# EAGLE design Daughter Card Schematic v3 (EAGLE 6.5.1)
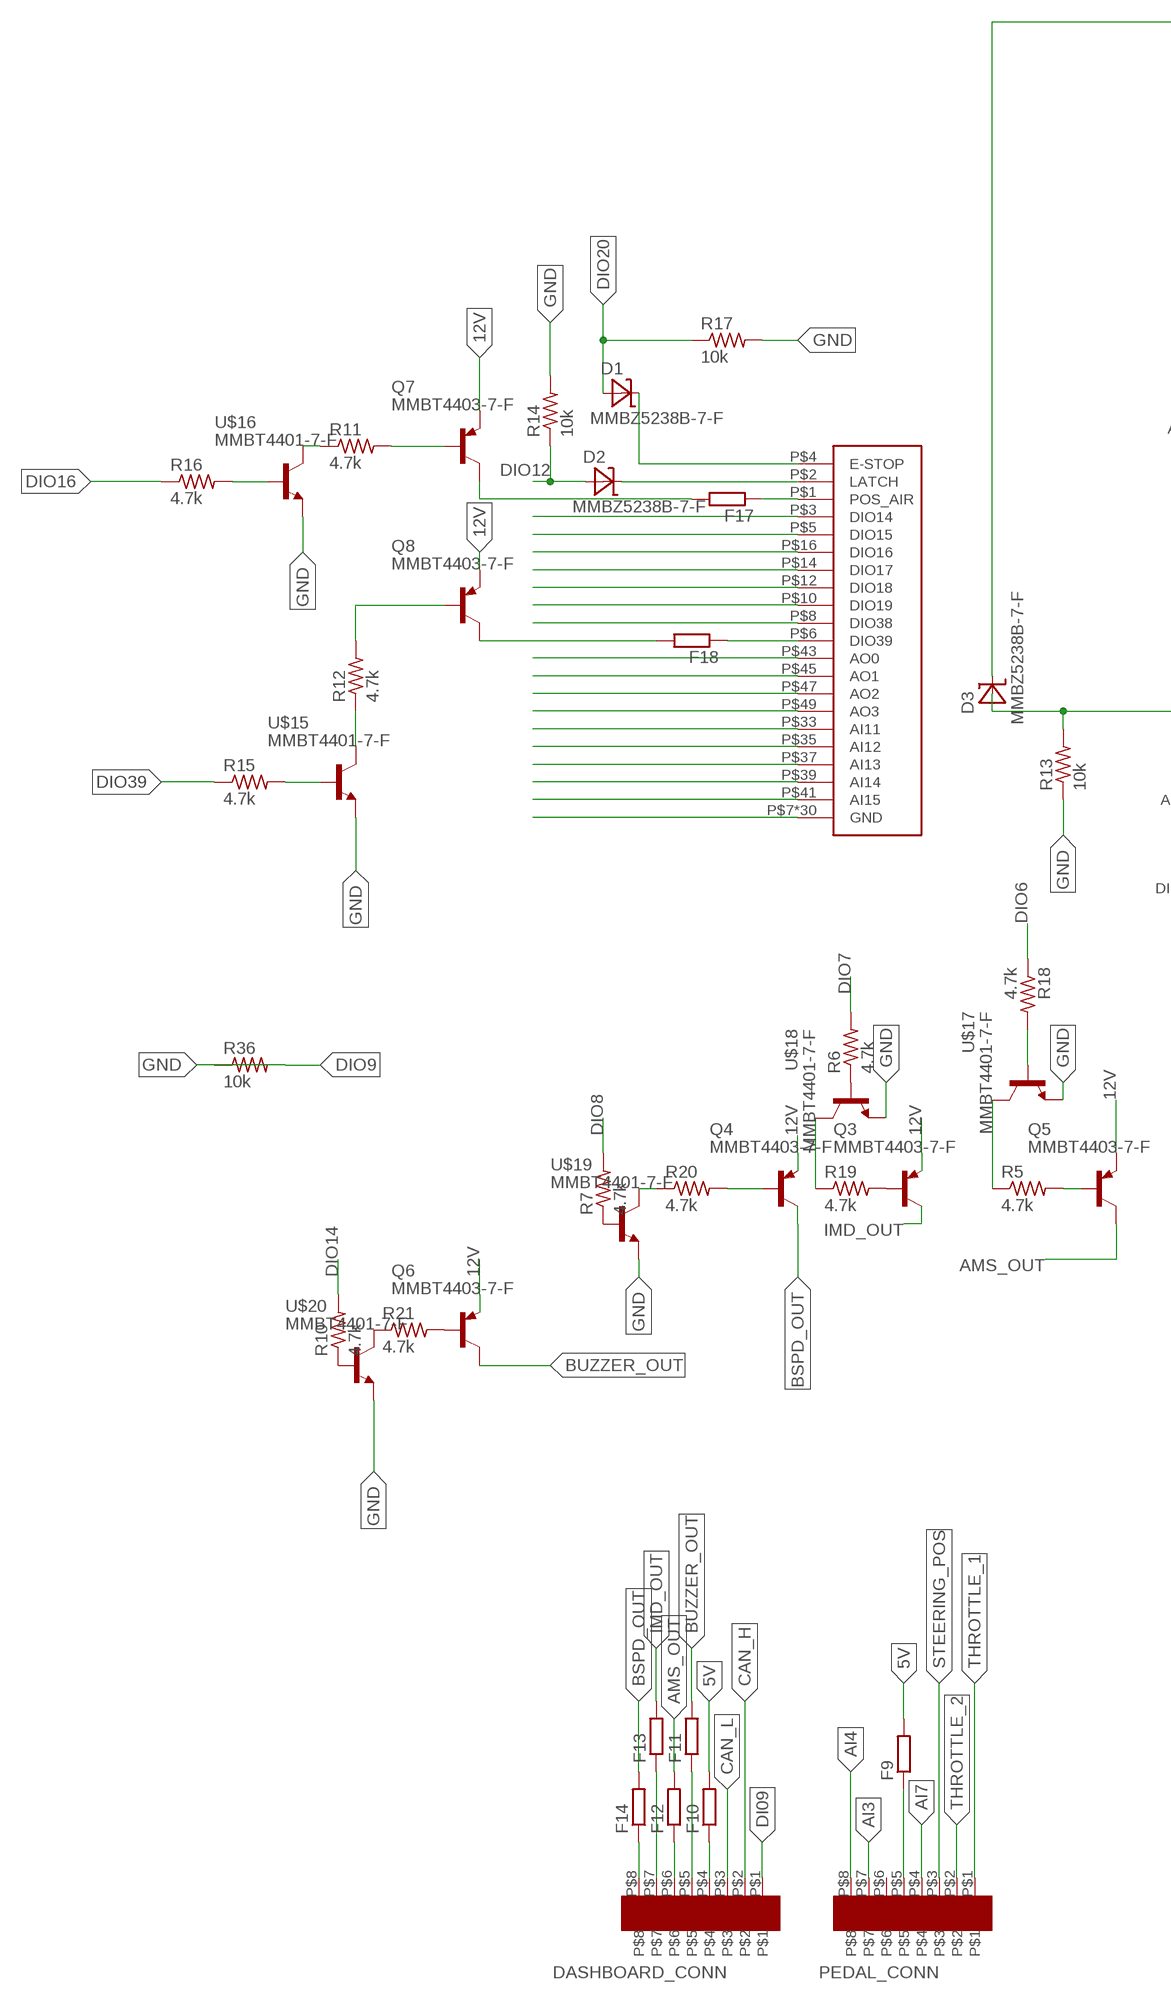
[diagram p0: schematic, sheet 1, part 1 of 2]
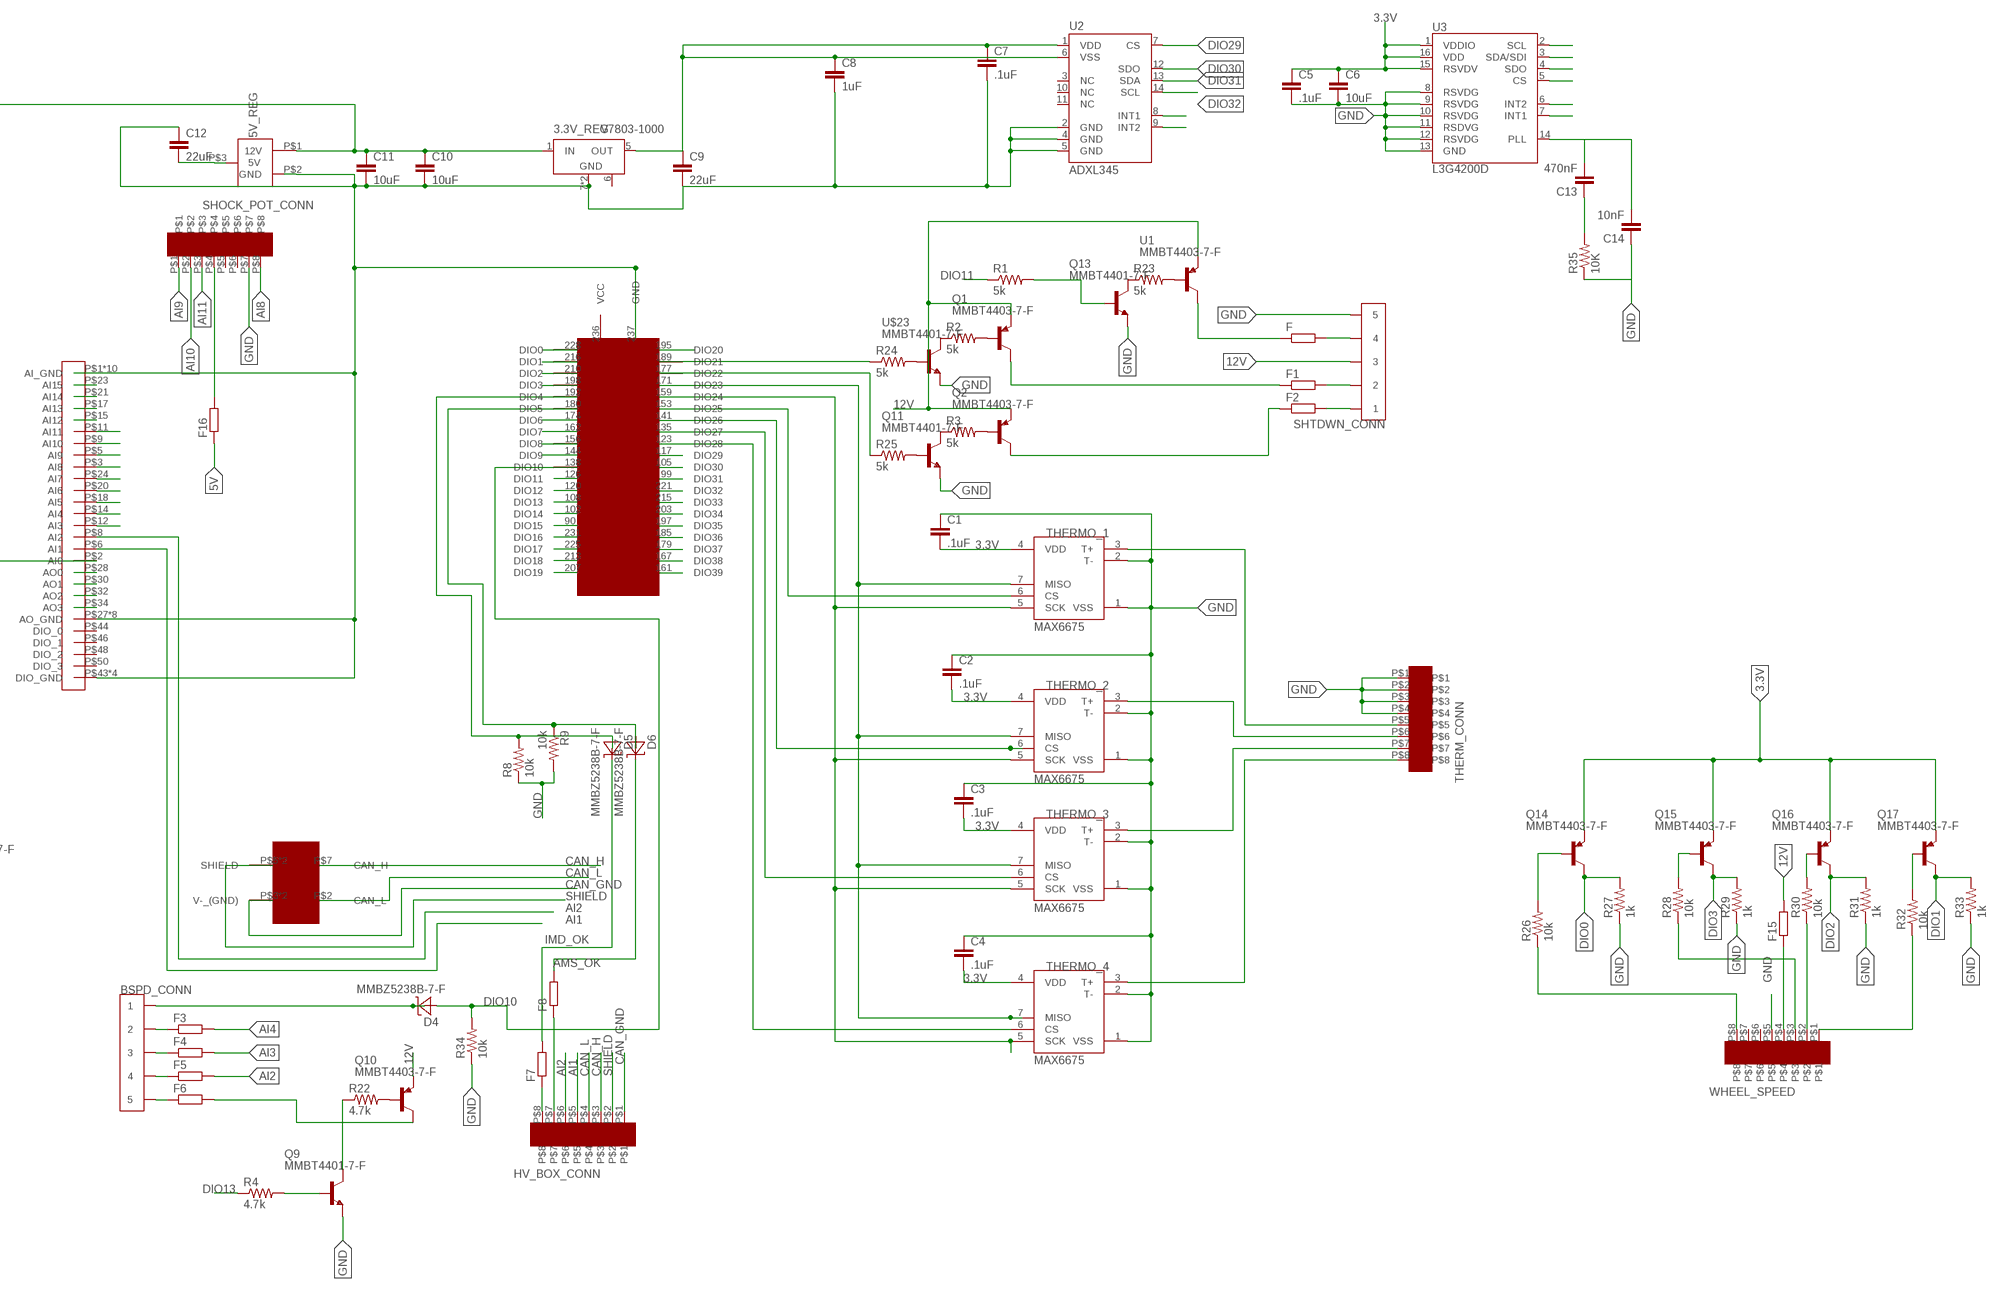
[diagram p1: schematic, sheet 1, part 2 of 2]

## Parts
3.3V_REG  V7803-1000  [V78XX-1000]
5V_REG  V78XX-1500  [V78XX-1500R]
BSPD_CONN  CONN_5  [CONNECTOR_5]
C1  .1uF  CAP0603-CAP  [0603-CAP]
C2  .1uF  CAP0603-CAP  [0603-CAP]
C3  .1uF  CAP0603-CAP  [0603-CAP]
C4  .1uF  CAP0603-CAP  [0603-CAP]
C5  .1uF  CAP0603-CAP  [0603-CAP]
C6  10uF  CAP0603-CAP  [0603-CAP]
C7  .1uF  CAP0603-CAP  [0603-CAP]
C8  1uF  CAP0603-CAP  [0603-CAP]
C9  22uF  CAP0603-CAP  [0603-CAP]
C10  10uF  CAP0603-CAP  [0603-CAP]
C11  10uF  CAP0603-CAP  [0603-CAP]
C12  22uF  CAP0603-CAP  [0603-CAP]
C13  470nF  CAP0603-CAP  [0603-CAP]
C14  10nF  CAP0603-CAP  [0603-CAP]
D1  MMBZ5238B-7-F  [SOT-23-3]
D2  MMBZ5238B-7-F  [SOT-23-3]
D3  MMBZ5238B-7-F  [SOT-23-3]
D4  MMBZ5238B-7-F  [SOT-23-3]
D5  MMBZ5238B-7-F  [SOT-23-3]
D6  MMBZ5238B-7-F  [SOT-23-3]
DASHBOARD_CONN  EN3_PCB_8  [EN3_PCB_8]
F  R-EU_R0402  [R0402]
F1  R-EU_R0402  [R0402]
F2  R-EU_R0402  [R0402]
F3  R-EU_R0402  [R0402]
F4  R-EU_R0402  [R0402]
F5  R-EU_R0402  [R0402]
F6  R-EU_R0402  [R0402]
F7  R-EU_R0402  [R0402]
F8  R-EU_R0402  [R0402]
F9  R-EU_R0402  [R0402]
F10  R-EU_R0402  [R0402]
F11  R-EU_R0402  [R0402]
F12  R-EU_R0402  [R0402]
F13  R-EU_R0402  [R0402]
F14  R-EU_R0402  [R0402]
F15  R-EU_R0402  [R0402]
F16  R-EU_R0402  [R0402]
F17  R-EU_R0402  [R0402]
F18  R-EU_R0402  [R0402]
HV_BOX_CONN  EN3_PCB_8  [EN3_PCB_8]
PEDAL_CONN  EN3_PCB_8  [EN3_PCB_8]
Q1  MMBT4403-7-F  [SOT-23-3]
Q2  MMBT4403-7-F  [SOT-23-3]
Q3  MMBT4403-7-F  [SOT-23-3]
Q4  MMBT4403-7-F  [SOT-23-3]
Q5  MMBT4403-7-F  [SOT-23-3]
Q6  MMBT4403-7-F  [SOT-23-3]
Q7  MMBT4403-7-F  [SOT-23-3]
Q8  MMBT4403-7-F  [SOT-23-3]
Q9  MMBT4401-7-F  [SOT-23-3]
Q10  MMBT4403-7-F  [SOT-23-3]
Q11  MMBT4401-7-F  [SOT-23-3]
Q13  MMBT4401-7-F  [SOT-23-3]
Q14  MMBT4403-7-F  [SOT-23-3]
Q15  MMBT4403-7-F  [SOT-23-3]
Q16  MMBT4403-7-F  [SOT-23-3]
Q17  MMBT4403-7-F  [SOT-23-3]
R1  5k  R-US_R0402  [R0402]
R2  5k  R-US_R0402  [R0402]
R3  5k  R-US_R0402  [R0402]
R4  4.7k  R-US_R0402  [R0402]
R5  4.7k  R-US_R0402  [R0402]
R6  4.7k  R-US_R0402  [R0402]
R7  4.7k  R-US_R0402  [R0402]
R8  10k  R-US_R0402  [R0402]
R9  10k  R-US_R0402  [R0402]
R10  4.7k  R-US_R0402  [R0402]
R11  4.7k  R-US_R0402  [R0402]
R12  4.7k  R-US_R0402  [R0402]
R13  10k  R-US_R0402  [R0402]
R14  10k  R-US_R0402  [R0402]
R15  4.7k  R-US_R0402  [R0402]
R16  4.7k  R-US_R0402  [R0402]
R17  10k  R-US_R0402  [R0402]
R18  4.7k  R-US_R0402  [R0402]
R19  4.7k  R-US_R0402  [R0402]
R20  4.7k  R-US_R0402  [R0402]
R21  4.7k  R-US_R0402  [R0402]
R22  4.7k  R-US_R0402  [R0402]
R23  5k  R-US_R0402  [R0402]
R24  5k  R-US_R0402  [R0402]
R25  5k  R-US_R0402  [R0402]
R26  10k  R-US_R0402  [R0402]
R27  1k  R-US_R0402  [R0402]
R28  10k  R-US_R0402  [R0402]
R29  1k  R-US_R0402  [R0402]
R30  10k  R-US_R0402  [R0402]
R31  1k  R-US_R0402  [R0402]
R32  10k  R-US_R0402  [R0402]
R33  1k  R-US_R0402  [R0402]
R34  10k  R-US_R0402  [R0402]
R35  10K  RESISTOR0603-RES  [0603-RES]
R36  10k  R-US_R0402  [R0402]
SBRIO_ANALOG  SBRIO_MIO  [SBRIO_J502_J503]
SBRIO_AUX  SBRIO_AUX  [SBRIO_J502_J503]
SHOCK_POT_CONN  EN3_PCB_8  [EN3_PCB_8]
SHTDWN_CONN  CONN_5  [CONNECTOR_5]
THERM_CONN  EN3_PCB_8  [EN3_PCB_8]
THERMO_1  MAX6675  [SO08]
THERMO_2  MAX6675  [SO08]
THERMO_3  MAX6675  [SO08]
THERMO_4  MAX6675  [SO08]
U1  MMBT4403-7-F  [SOT-23-3]
U2  ADXL345  [LGA14]
U3  L3G4200D  [LGA16-4X4]
U$2  SBRIO_W500  [SBRIO_W]
U$3  SBRIO_RMC  [SEAM-40-XX.X-XX-06-X-A]
U$15  MMBT4401-7-F  [SOT-23-3]
U$16  MMBT4401-7-F  [SOT-23-3]
U$17  MMBT4401-7-F  [SOT-23-3]
U$18  MMBT4401-7-F  [SOT-23-3]
U$19  MMBT4401-7-F  [SOT-23-3]
U$20  MMBT4401-7-F  [SOT-23-3]
U$23  MMBT4401-7-F  [SOT-23-3]
WHEEL_SPEED  EN3_PCB_8  [EN3_PCB_8]

## Nets
3.3V: 3.3V_REG.5(OUT) C1.2 C2.2 C3.2 C4.2 C5.1 C6.1 C7.1 C8.1 C9.1 Q14.P$3(E) Q15.P$3(E) Q16.P$3(E) Q17.P$3(E) THERMO_1.4(VDD) THERMO_2.4(VDD) THERMO_3.4(VDD) THERMO_4.4(VDD) U2.1(VDD) U2.6(VSS) U3.1(VDDIO) U3.15(RSVDV) U3.16(VDD)
5V: 5V_REG.P$3(5V) C12.2 F9.2 F10.2 F16.1
12V: 3.3V_REG.1(IN) 5V_REG.P$1(12V) C10.1 C11.1 D3.P$1(C) F15.2 Q1.P$3(E) Q2.P$3(E) Q3.P$3(E) Q4.P$3(E) Q5.P$3(E) Q6.P$3(E) Q7.P$3(E) Q8.P$3(E) Q10.P$3(E) SHTDWN_CONN.5 SHTDWN_CONN.6 U1.P$3(E)
AI1: HV_BOX_CONN.P$5 SBRIO_ANALOG.P$6(AI1)
AI2: F5.2 HV_BOX_CONN.P$6 SBRIO_ANALOG.P$8(AI2)
AI3: F4.2 PEDAL_CONN.P$7 SBRIO_ANALOG.P$12(AI3)
AI4: F3.2 PEDAL_CONN.P$8 SBRIO_ANALOG.P$14(AI4)
AI7: PEDAL_CONN.P$4 SBRIO_ANALOG.P$24(AI7)
AI8: SBRIO_ANALOG.P$3(AI8) SHOCK_POT_CONN.P$8
AI9: SBRIO_ANALOG.P$5(AI9) SHOCK_POT_CONN.P$1
AI10: SBRIO_ANALOG.P$9(AI10) SHOCK_POT_CONN.P$2
AI11: SBRIO_ANALOG.P$11(AI11) SBRIO_AUX.P$33(AI11) SHOCK_POT_CONN.P$3
AI12: SBRIO_ANALOG.P$15(AI12) SBRIO_AUX.P$35(AI12)
AI13: SBRIO_ANALOG.P$17(AI13) SBRIO_AUX.P$37(AI13)
AI15: SBRIO_ANALOG.P$23(AI15) SBRIO_AUX.P$41(AI15)
AMS_OK: D6.P$1(C) F8.2
AMS_OUT: F12.2 Q5.P$1(C)
AO0: SBRIO_ANALOG.P$28(AO0) SBRIO_AUX.P$43(AO0)
AO1: SBRIO_ANALOG.P$30(AO1) SBRIO_AUX.P$45(AO1)
AO2: SBRIO_ANALOG.P$32(AO2) SBRIO_AUX.P$47(AO2)
AO3: SBRIO_ANALOG.P$34(AO3) SBRIO_AUX.P$49(AO3)
BSPD_OUT: F14.2 Q4.P$1(C)
BUZZER_OUT: F11.2 Q6.P$1(C)
CAN_GND: HV_BOX_CONN.P$1 U$2.P$3(V-_(GND)) U$2.P$6(V-_(GND))
CAN_H: DASHBOARD_CONN.P$2 HV_BOX_CONN.P$3 U$2.P$7(CAN_H)
CAN_L: DASHBOARD_CONN.P$3 HV_BOX_CONN.P$4 U$2.P$2(CAN_L)
DI09: DASHBOARD_CONN.P$1
DIO0: Q14.P$1(C) R27.2 U$3.228(DIO0)
DIO1: Q17.P$1(C) R33.2 U$3.216(DIO1)
DIO2: Q16.P$1(C) R31.2 U$3.210(DIO2)
DIO3: Q15.P$1(C) R29.2 U$3.198(DIO3)
DIO6: R18.1 U$3.174(DIO6)
DIO7: R6.2 U$3.162(DIO7)
DIO8: R7.2 U$3.156(DIO8)
DIO9: R36.2 U$3.144(DIO9)
DIO10: D4.P$2(A) R34.2 U$3.138(DIO10)
DIO11: R1.1 U$3.126(DIO11)
DIO12: D2.P$2(A) R14.1 U$3.120(DIO12)
DIO13: R4.1 U$3.108(DIO13)
DIO14: R10.2 SBRIO_AUX.P$3(DIO14) U$3.102(DIO14)
DIO15: SBRIO_AUX.P$5(DIO15) U$3.90(DIO15)
DIO16: R16.1 SBRIO_AUX.P$16(DIO16) U$3.231(DIO16)
DIO17: SBRIO_AUX.P$14(DIO17) U$3.225(DIO17)
DIO18: SBRIO_AUX.P$12(DIO18) U$3.213(DIO18)
DIO19: SBRIO_AUX.P$10(DIO19) U$3.207(DIO19)
DIO20: D1.P$2(A) R17.1 U$3.195(DIO20)
DIO29: U2.7(CS) U$3.117(DIO29)
DIO30: U2.12(SDO) U3.4(SDO) U$3.105(DIO30)
DIO31: U2.13(SDA) U3.3(SDA/SDI) U$3.99(DIO31)
DIO32: U2.14(SCL) U3.2(SCL) U$3.221(DIO32)
DIO33: U3.5(CS) U$3.215(DIO33)
DIO34: U3.7(INT1) U$3.203(DIO34)
DIO35: U3.6(INT2) U$3.197(DIO35)
DIO36: U2.8(INT1) U$3.185(DIO36)
DIO37: U2.9(INT2) U$3.179(DIO37)
DIO38: SBRIO_AUX.P$8(DIO38) U$3.167(DIO38)
DIO39: R15.1 U$3.161(DIO39)
GND: 3.3V_REG.7(GND) 3.3V_REG.9(GND) 5V_REG.P$2(GND) C1.1 C2.1 C3.1 C4.1 C5.2 C6.2 C7.2 C8.2 C9.2 C10.2 C11.2 C12.1 C14.1 Q9.P$3(E) Q11.P$3(E) Q13.P$3(E) R8.1 R9.2 R13.1 R14.2 R17.2 R27.1 R29.1 R31.1 R33.1 R34.1 R35.1 R36.1 SBRIO_ANALOG.P$1(AI_GND) SBRIO_ANALOG.P$4(AI_GND) SBRIO_ANALOG.P$7(AI_GND) SBRIO_ANALOG.P$10(AI_GND) SBRIO_ANALOG.P$13(AI_GND) SBRIO_ANALOG.P$16(AI_GND) SBRIO_ANALOG.P$19(AI_GND) SBRIO_ANALOG.P$22(AI_GND) SBRIO_ANALOG.P$25(AI_GND) SBRIO_ANALOG.P$26(AI_GND) SBRIO_ANALOG.P$27(AO_GND) SBRIO_ANALOG.P$29(AO_GND) SBRIO_ANALOG.P$31(AO_GND) SBRIO_ANALOG.P$33(AO_GND) SBRIO_ANALOG.P$35(AO_GND) SBRIO_ANALOG.P$37(AO_GND) SBRIO_ANALOG.P$39(AO_GND) SBRIO_ANALOG.P$41(AO_GND) SBRIO_ANALOG.P$43(DIO_GND) SBRIO_ANALOG.P$45(DIO_GND) SBRIO_ANALOG.P$47(DIO_GND) SBRIO_ANALOG.P$49(DIO_GND) SBRIO_AUX.P$7(GND) SBRIO_AUX.P$9(GND) SBRIO_AUX.P$11(GND) SBRIO_AUX.P$13(GND) SBRIO_AUX.P$15(GND) SBRIO_AUX.P$17(GND) SBRIO_AUX.P$18(GND) SBRIO_AUX.P$19(GND) SBRIO_AUX.P$20(GND) SBRIO_AUX.P$21(GND) SBRIO_AUX.P$22(GND) SBRIO_AUX.P$23(GND) SBRIO_AUX.P$24(GND) SBRIO_AUX.P$25(GND) SBRIO_AUX.P$26(GND) SBRIO_AUX.P$27(GND) SBRIO_AUX.P$28(GND) SBRIO_AUX.P$29(GND) SBRIO_AUX.P$30(GND) SBRIO_AUX.P$31(GND) SBRIO_AUX.P$32(GND) SBRIO_AUX.P$34(GND) SBRIO_AUX.P$36(GND) SBRIO_AUX.P$38(GND) SBRIO_AUX.P$40(GND) SBRIO_AUX.P$42(GND) SBRIO_AUX.P$44(GND) SBRIO_AUX.P$46(GND) SBRIO_AUX.P$48(GND) SBRIO_AUX.P$50(GND) SHOCK_POT_CONN.P$7 SHTDWN_CONN.9 SHTDWN_CONN.10 THERM_CONN.P$1 THERM_CONN.P$2 THERM_CONN.P$3 THERM_CONN.P$4 THERMO_1.1(VSS) THERMO_1.2(T-) THERMO_2.1(VSS) THERMO_2.2(T-) THERMO_3.1(VSS) THERMO_3.2(T-) THERMO_4.1(VSS) THERMO_4.2(T-) U2.2(GND) U2.4(GND) U2.5(GND) U3.8(RSVDG) U3.9(RSVDG) U3.10(RSVDG) U3.11(RSDVG) U3.12(RSVDG) U3.13(GND) U$3.237(GND) U$15.P$3(E) U$16.P$3(E) U$17.P$3(E) U$18.P$3(E) U$19.P$3(E) U$20.P$3(E) U$23.P$3(E) WHEEL_SPEED.P$5
IMD_OK: D5.P$1(C) F7.2
IMD_OUT: F13.2 Q3.P$1(C)
N$1: D2.P$1(C) SBRIO_AUX.P$2(LATCH)
N$2: D1.P$1(C) SBRIO_AUX.P$4(E-STOP)
N$3: R32.1 WHEEL_SPEED.P$1
N$4: D3.P$2(A) R13.2 SBRIO_ANALOG.P$2(AI0)
N$5: Q6.P$2(B) R21.2
N$6: Q16.P$2(B) R30.2
N$7: F1.1 Q1.P$1(C)
N$8: F2.1 Q2.P$1(C)
N$9: R28.1 WHEEL_SPEED.P$3
N$10: R26.1 WHEEL_SPEED.P$8
N$11: R24.1 U$3.189(DIO21)
N$12: R25.1 U$3.177(DIO22)
N$13: F8.1 HV_BOX_CONN.P$7
N$14: F7.1 HV_BOX_CONN.P$8
N$15: D5.P$2(A) R8.2 U$3.192(DIO4)
N$16: D6.P$2(A) R9.1 U$3.180(DIO5)
N$17: THERMO_1.7(MISO) THERMO_2.7(MISO) THERMO_3.7(MISO) THERMO_4.7(MISO) U$3.171(DIO23)
N$18: THERMO_1.5(SCK) THERMO_2.5(SCK) THERMO_3.5(SCK) THERMO_4.5(SCK) U$3.159(DIO24)
N$20: F16.2 SHOCK_POT_CONN.P$4
N$21: F15.1 WHEEL_SPEED.P$4
N$22: F9.1 PEDAL_CONN.P$5
N$23: DASHBOARD_CONN.P$4 F10.1
N$24: DASHBOARD_CONN.P$5 F11.1
N$25: THERMO_1.6(CS) U$3.153(DIO25)
N$26: THERMO_2.6(CS) U$3.141(DIO26)
N$27: THERMO_3.6(CS) U$3.135(DIO27)
N$28: THERMO_4.6(CS) U$3.123(DIO28)
N$29: THERM_CONN.P$5 THERMO_1.3(T+)
N$30: THERM_CONN.P$6 THERMO_2.3(T+)
N$31: THERM_CONN.P$7 THERMO_3.3(T+)
N$32: THERM_CONN.P$8 THERMO_4.3(T+)
N$33: DASHBOARD_CONN.P$6 F12.1
N$34: DASHBOARD_CONN.P$7 F13.1
N$35: DASHBOARD_CONN.P$8 F14.1
N$36: F.2 SHTDWN_CONN.7 SHTDWN_CONN.8
N$37: C13.2 C14.2 U3.14(PLL)
N$38: C13.1 R35.2
N$39: F1.2 SHTDWN_CONN.3 SHTDWN_CONN.4
N$40: F2.2 SHTDWN_CONN.1 SHTDWN_CONN.2
N$41: BSPD_CONN.9 BSPD_CONN.10 F6.1
N$42: BSPD_CONN.1 BSPD_CONN.2 D4.P$1(C)
N$43: BSPD_CONN.7 BSPD_CONN.8 F5.1
N$44: F.1 U1.P$1(C)
N$45: F6.2 Q10.P$1(C)
N$46: R23.2 U1.P$2(B)
N$47: Q1.P$2(B) R2.2
N$48: Q2.P$2(B) R3.2
N$49: Q10.P$2(B) R22.2
N$50: Q5.P$2(B) R5.2
N$51: Q3.P$2(B) R19.2
N$52: BSPD_CONN.5 BSPD_CONN.6 F4.1
N$53: BSPD_CONN.3 BSPD_CONN.4 F3.1
N$54: Q7.P$2(B) R11.2
N$55: F17.1 SBRIO_AUX.P$1(POS_AIR)
N$56: F17.2 Q7.P$1(C)
N$57: F18.2 Q8.P$1(C)
N$58: Q8.P$2(B) R12.2
N$59: F18.1 SBRIO_AUX.P$6(DIO39)
N$60: R15.2 U$15.P$2(B)
N$61: R12.1 U$15.P$1(C)
N$62: R16.2 U$16.P$2(B)
N$63: R11.1 U$16.P$1(C)
N$64: R5.1 U$17.P$1(C)
N$65: R18.2 U$17.P$2(B)
N$66: R19.1 U$18.P$1(C)
N$67: R6.1 U$18.P$2(B)
N$68: Q4.P$2(B) R20.2
N$69: R20.1 U$19.P$1(C)
N$70: R7.1 U$19.P$2(B)
N$71: R21.1 U$20.P$1(C)
N$72: R10.1 U$20.P$2(B)
N$73: Q9.P$1(C) R22.1
N$74: Q9.P$2(B) R4.2
N$75: Q13.P$1(C) R23.1
N$76: Q13.P$2(B) R1.2
N$77: R2.1 U$23.P$1(C)
N$78: Q11.P$1(C) R3.1
N$79: R24.2 U$23.P$2(B)
N$80: Q11.P$2(B) R25.2
N$81: Q14.P$2(B) R26.2
N$82: Q15.P$2(B) R28.2
N$83: R30.1 WHEEL_SPEED.P$2
N$84: Q17.P$2(B) R32.2
SHIELD: HV_BOX_CONN.P$2 U$2.P$5(SHIELD) U$2.P$10(SHIELD)
STEERING_POS: PEDAL_CONN.P$3 SBRIO_ANALOG.P$21(AI14) SBRIO_AUX.P$39(AI14)
THROTTLE_1: PEDAL_CONN.P$1 SBRIO_ANALOG.P$18(AI5)
THROTTLE_2: PEDAL_CONN.P$2 SBRIO_ANALOG.P$20(AI6)
Unconnected: 3.3V_REG.6 PEDAL_CONN.P$6 SBRIO_ANALOG.P$44(DIO_0) SBRIO_ANALOG.P$46(DIO_1) SBRIO_ANALOG.P$48(DIO_2) SBRIO_ANALOG.P$50(DIO_3) SHOCK_POT_CONN.P$5 SHOCK_POT_CONN.P$6 U2.3(NC) U2.10(NC) U2.11(NC) WHEEL_SPEED.P$6 WHEEL_SPEED.P$7

## Power pins joined to a net without a drawn wire
VCC: U$3.236(VCC)

## Library data of the parts
3.3V_REG = formula electric:V7803-1000
5V_REG = formula electric:V78XX-1500
BSPD_CONN SHTDWN_CONN = formula electric:CONN_5
C1-C14 = SparkFun-Passives:CAP: Capacitor Standard 0603 ceramic capacitor, and 0.1" leaded capacitor.
D1-D6 = formula electric:MMBZ5238B-7-F: Digikey: MMBZ5238B-FDICT-ND
DASHBOARD_CONN HV_BOX_CONN PEDAL_CONN SHOCK_POT_CONN THERM_CONN WHEEL_SPEED = formula electric:EN3_PCB_8
F F1-F18 = resistor:R-EU_: RESISTOR, European symbol
Q1-Q8 Q10 Q14-Q17 U1 = formula electric:MMBT4403-7-F
Q9 Q11 Q13 U$15-U$20 U$23 = formula electric:MMBT4401-7-F
R1-R34 R36 = resistor:R-US_: RESISTOR, American symbol
R35 = SparkFun-Passives:RESISTOR: Resistor Basic schematic elements and footprints for 0603, 1206, and PTH resistors.
SBRIO_ANALOG = formula electric:SBRIO_MIO
SBRIO_AUX = formula electric:SBRIO_AUX: An output for a lot of the extra pins on the sbRIO.
THERMO_1-THERMO_4 = max6675:MAX6675
U2 = SparkFun-Sensors:ADXL345: 3-axis SPI/I2C 2/4/8/16g accelerometer
U3 = SparkFun-Sensors:L3G4200D: L3G4200D Three-axis, digital output gyroscope The L3G4200D is a low-power three-axis angular rate sensor, has a full scale of ±250/±500/±2000 dps and is capable of measuring rates with a user-selectable bandwidth. It includes a sensing element and an IC interface capable of providing the measured angular rate to the external world through a digital interface (I2C/SPI). Package: 4x4x1.1 LGA-16 (LGA16-4x4.PAC)
U$2 = formula electric:SBRIO_W500
U$3 = SEAM-40-XX.X-XX-06-X-A:SBRIO_RMC

## Net classes
0 default: clearance 0.205 mm

## Board
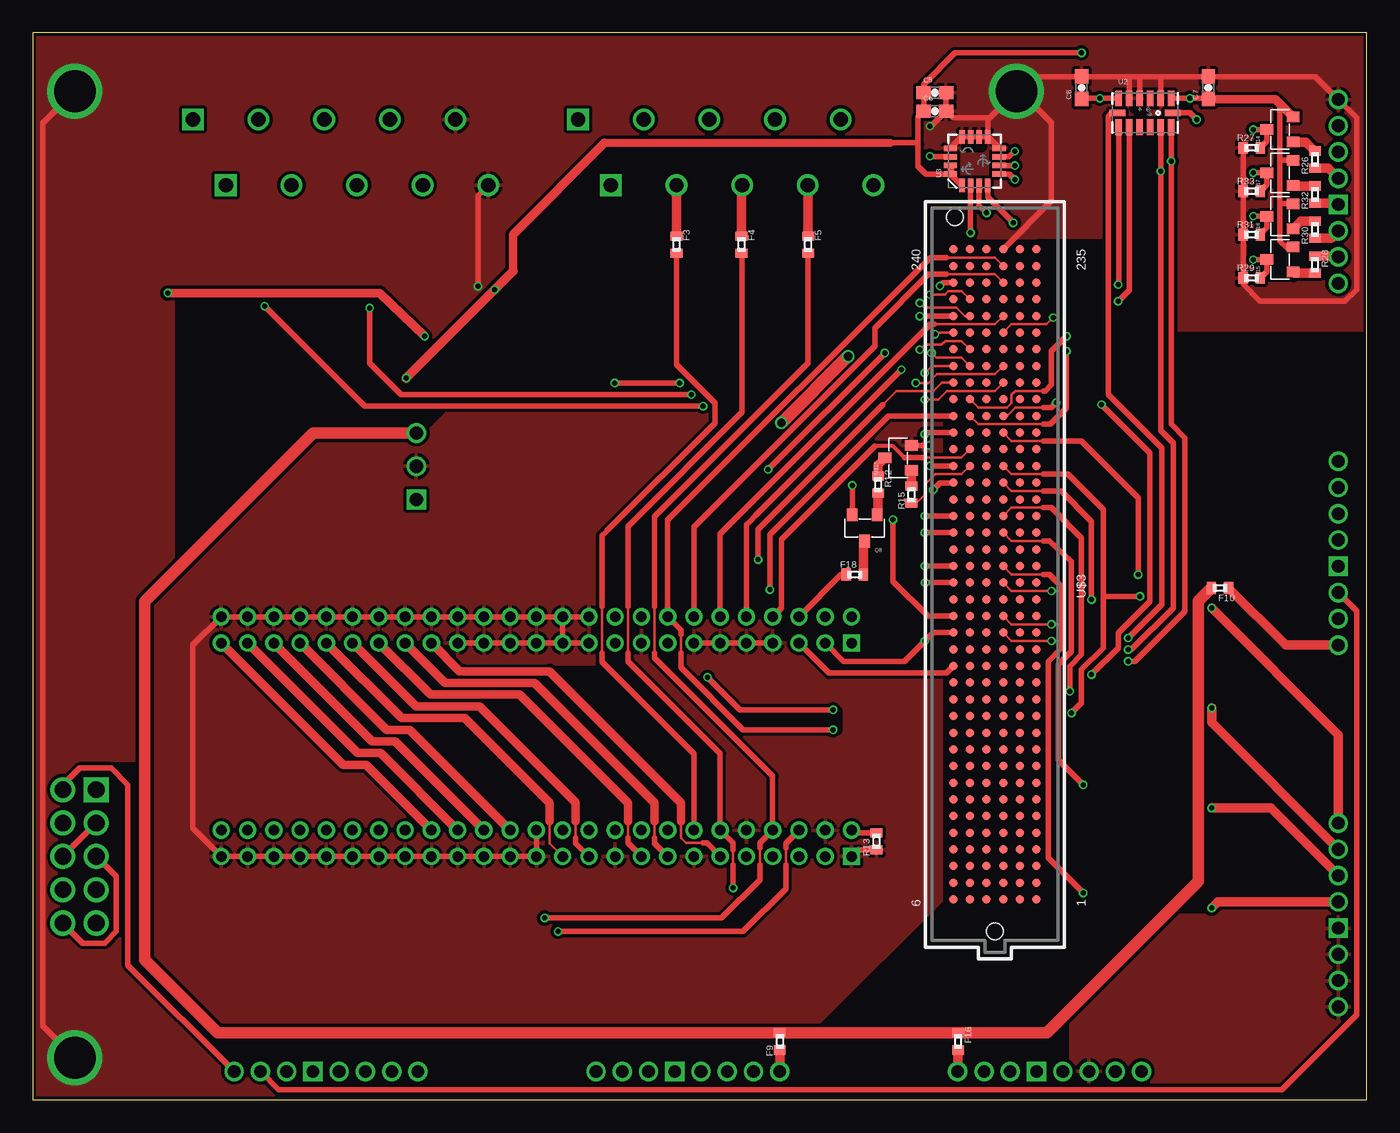
[diagram p2: board, top side]
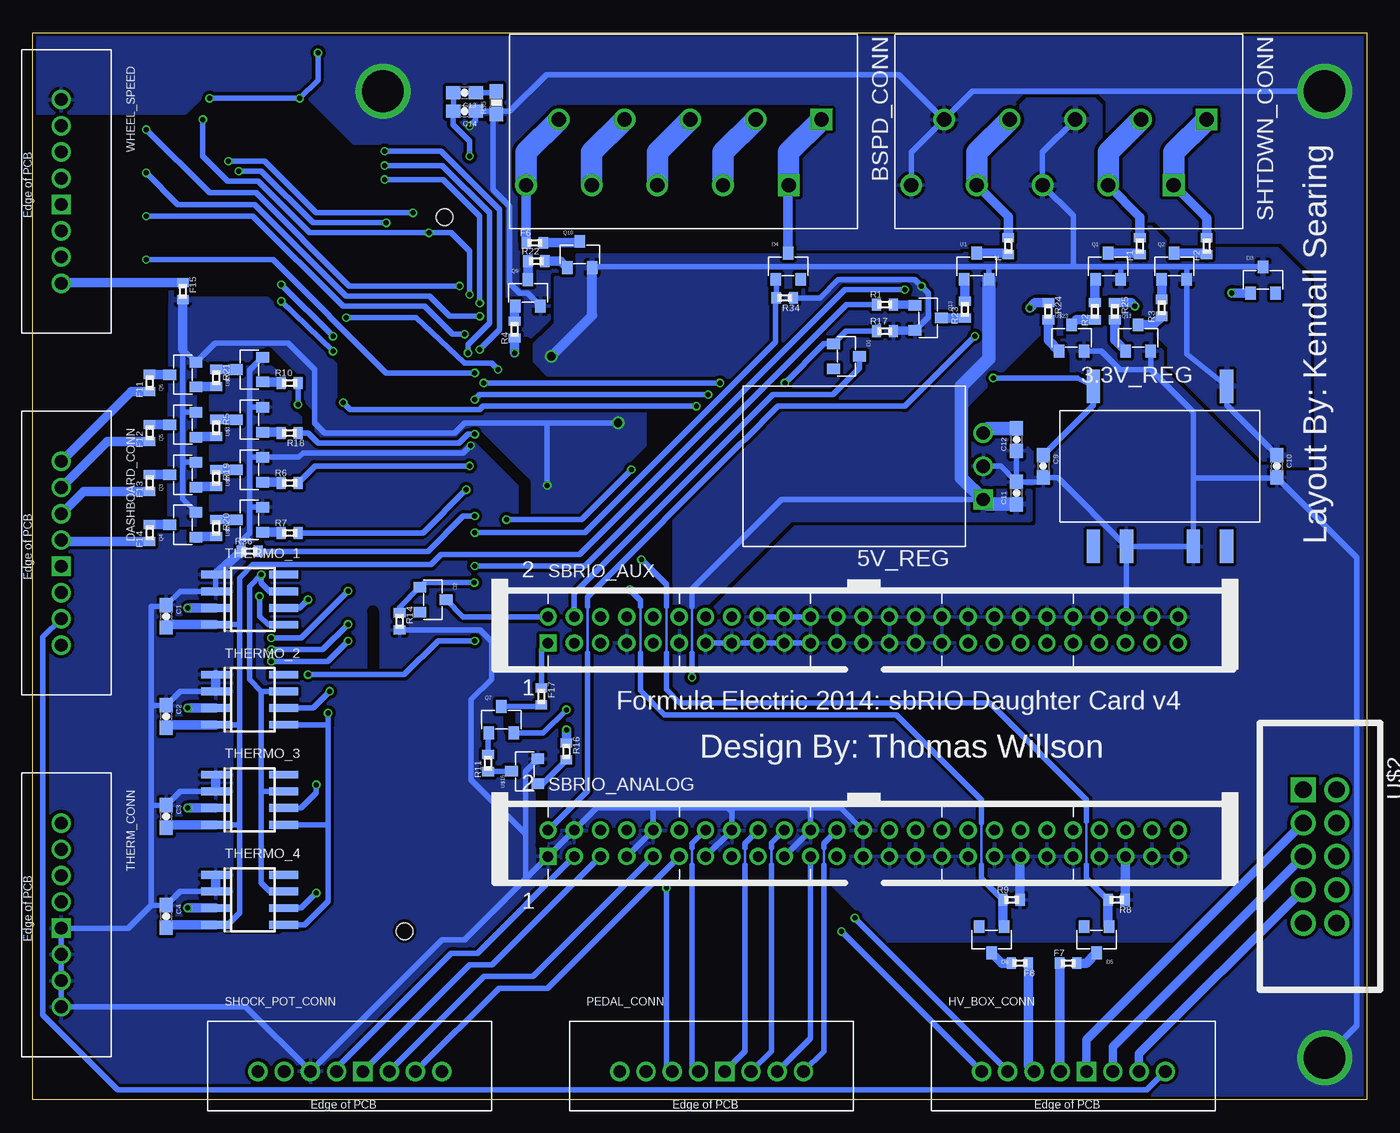
[diagram p3: board, bottom side, seen from below]

Size 101.6 x 81.28 mm. Coordinates in mm from the lower left corner, seen from the top.
Outline: 0,0 101.6,0 101.6,81.28 0,81.28 0,0
Copper layers (1*16): Top 0.035mm / dielectric 1.5mm / Bottom 0.035mm
Design rules "PCBFabExpress DRC": minimum track width 6mil, minimum drill 15mil, track to track 6mil, track to pad 8mil, pad to pad 8mil, via to via 8mil, smd to smd 8mil, copper to edge 10mil, drill to drill 8mil, minimum pad ring 10mil, minimum via ring 5mil, stop-mask expansion 2mil, vias tented up to drill 15mil, thermal gap 10mil
tRestrict: area 69.6,14.7 to 77,65.3; area 47.9,20.1 to 48.9,21.1; area 55.9,18.1 to 56.9,19; area 37.9,20.1 to 38.8,21.1; area 43.8,34.3 to 44.8,35.3; area 47.9,34.3 to 48.9,35.3; area 43.8,36.3 to 44.8,37.3; area 45.9,36.3 to 46.8,37.3; area 41.9,20.1 to 42.9,21.1; 14 lines
bRestrict: area 49.8,18.1 to 50.8,19; area 55.9,18.1 to 56.9,19; area 43.8,18.1 to 44.8,19; area 53.9,34.3 to 54.8,35.3; 28 lines

### Footprints (pad centres in the part's own frame; a part is rotated, then mirrored left to right if it is on the bottom)
V78XX-1000 = smd 1 x 2.54: 1 -5.08,-6.096; 5 5.08,-6.096; 6 5.08,6.096; 7 2.54,6.096; 9 -2.54,6.096; 10 -5.08,6.096
V78XX-1500R = drill 1 square: P$1 0,2.54 | drill 1: P$2 0,0; P$3 0,-2.54
CONNECTOR_5 = drill 1.1 square: 1 0,0; 2 2.5,5 | drill 1.1: 3 5,0; 4 7.5,5; 5 10,0; 6 12.5,5; 7 15,0; 8 17.5,5; 9 20,0; 10 22.5,5
0603-CAP = smd 1.1 x 1: 1 -0.85,0; 2 0.85,0
SOT-23-3 = smd 0.8 x 0.976: P$1 0,1; P$2 -0.95,-1; P$3 0.95,-1
EN3_PCB_8 = drill 0.965 pad 1.397 square: P$1 0,0 | drill 0.965 pad 1.397: P$2 2,0; P$3 4,0; P$4 6,0; P$5 -8,0; P$6 -6,0; P$7 -4,0; P$8 -2,0
R0402 = smd 0.7 x 0.9: 1 -0.65,0; 2 0.65,0
0603-RES = smd 1.1 x 1: 1 -0.85,0; 2 0.85,0
SBRIO_J502_J503 = drill 0.8 square: P$1 0,0 | drill 0.8: P$2 0,2; P$3 2,0; P$4 2,2; P$5 4,0; P$6 4,2; P$7 6,0; P$8 6,2; P$9 8,0; P$10 8,2; P$11 10,0; P$12 10,2; P$13 12,0; P$14 12,2; P$15 14,0; P$16 14,2; P$17 16,0; P$18 16,2; P$19 18,0; P$20 18,2; P$21 20,0; P$22 20,2; P$23 22,0; P$24 22,2; P$25 24,0; P$26 24,2; P$27 26,0; P$28 26,2; P$29 28,0; P$30 28,2; P$31 30,0; P$32 30,2; P$33 32,0; P$34 32,2; P$35 34,0; P$36 34,2; P$37 36,0; P$38 36,2; P$39 38,0; P$40 38,2; P$41 40,0; P$42 40,2; P$43 42,0; P$44 42,2; P$45 44,0; P$46 44,2; P$47 46,0; P$48 46,2; P$49 48,0; P$50 48,2
SO08 = smd 0.6 x 2.2: 1 -1.905,-2.6; 2 -0.635,-2.6; 3 0.635,-2.6; 4 1.905,-2.6; 5 1.905,2.6; 6 0.635,2.6; 7 -0.635,2.6; 8 -1.905,2.6
LGA14 = smd 0.5 x 1.2: 1 2,1.1; 2 1.2,1.1; 3 0.4,1.1; 4 -0.4,1.1; 5 -1.2,1.1; 6 -2,1.1; 8 -2,-1.1; 9 -1.2,-1.1; 10 -0.4,-1.1; 11 0.4,-1.1; 12 1.2,-1.1; 13 2,-1.1 | smd 1.2 x 0.5: 7 -2.1,0; 14 2.1,0
LGA16-4X4 = smd 1 x 0.4: 1 -1.85,0.975; 2 -1.85,0.325; 3 -1.85,-0.325; 4 -1.85,-0.975; 9 1.85,-0.975; 10 1.85,-0.325; 11 1.85,0.325; 12 1.85,0.975 | smd 0.4 x 1: 5 -0.975,-1.85; 6 -0.325,-1.85; 7 0.325,-1.85; 8 0.975,-1.85; 13 0.975,1.85; 14 0.325,1.85; 15 -0.325,1.85; 16 -0.975,1.85
SBRIO_W = drill 1.27 pad 1.778 square: P$1 -5.08,-1.27 | drill 1.27 pad 1.778: P$2 -5.08,1.27; P$3 -2.54,-1.27; P$4 -2.54,1.27; P$5 0,-1.27; P$6 0,1.27; P$7 2.54,-1.27; P$8 2.54,1.27; P$9 5.08,-1.27; P$10 5.08,1.27
SEAM-40-XX.X-XX-06-X-A = smd 0.635 x 0.635: 1 24.765,3.175; 2 24.765,1.905; 3 24.765,0.635; 4 24.765,-0.635; 5 24.765,-1.905; 6 24.765,-3.175; 7 23.495,3.175; 8 23.495,1.905; 9 23.495,0.635; 10 23.495,-0.635; 11 23.495,-1.905; 12 23.495,-3.175; 13 22.225,3.175; 14 22.225,1.905; 15 22.225,0.635; 16 22.225,-0.635; 17 22.225,-1.905; 18 22.225,-3.175; 19 20.955,3.175; 20 20.955,1.905; 21 20.955,0.635; 22 20.955,-0.635; 23 20.955,-1.905; 24 20.955,-3.175; 25 19.685,3.175; 26 19.685,1.905; 27 19.685,0.635; 28 19.685,-0.635; 29 19.685,-1.905; 30 19.685,-3.175; 31 18.415,3.175; 32 18.415,1.905; 33 18.415,0.635; 34 18.415,-0.635; 35 18.415,-1.905; 36 18.415,-3.175; 37 17.145,3.175; 38 17.145,1.905; 39 17.145,0.635; 40 17.145,-0.635; 41 17.145,-1.905; 42 17.145,-3.175; 43 15.875,3.175; 44 15.875,1.905; 45 15.875,0.635; 46 15.875,-0.635; 47 15.875,-1.905; 48 15.875,-3.175; 49 14.605,3.175; 50 14.605,1.905; 51 14.605,0.635; 52 14.605,-0.635; 53 14.605,-1.905; 54 14.605,-3.175; 55 13.335,3.175; 56 13.335,1.905; 57 13.335,0.635; 58 13.335,-0.635; 59 13.335,-1.905; 60 13.335,-3.175; 61 12.065,3.175; 62 12.065,1.905; 63 12.065,0.635; 64 12.065,-0.635; 65 12.065,-1.905; 66 12.065,-3.175; 67 10.795,3.175; 68 10.795,1.905; 69 10.795,0.635; 70 10.795,-0.635; 71 10.795,-1.905; 72 10.795,-3.175; 73 9.525,3.175; 74 9.525,1.905; 75 9.525,0.635; 76 9.525,-0.635; 77 9.525,-1.905; 78 9.525,-3.175; 79 8.255,3.175; 80 8.255,1.905; 81 8.255,0.635; 82 8.255,-0.635; 83 8.255,-1.905; 84 8.255,-3.175; 85 6.985,3.175; 86 6.985,1.905; 87 6.985,0.635; 88 6.985,-0.635; 89 6.985,-1.905; 90 6.985,-3.175; 91 5.715,3.175; 92 5.715,1.905; 93 5.715,0.635; 94 5.715,-0.635; 95 5.715,-1.905; 96 5.715,-3.175; 97 4.445,3.175; 98 4.445,1.905; 99 4.445,0.635; 100 4.445,-0.635; 101 4.445,-1.905; 102 4.445,-3.175; 103 3.175,3.175; 104 3.175,1.905; 105 3.175,0.635; 106 3.175,-0.635; 107 3.175,-1.905; 108 3.175,-3.175; 109 1.905,3.175; 110 1.905,1.905; 111 1.905,0.635; 112 1.905,-0.635; 113 1.905,-1.905; 114 1.905,-3.175; 115 0.635,3.175; 116 0.635,1.905; 117 0.635,0.635; 118 0.635,-0.635; 119 0.635,-1.905; 120 0.635,-3.175; 121 -0.635,3.175; 122 -0.635,1.905; 123 -0.635,0.635; 124 -0.635,-0.635; 125 -0.635,-1.905; 126 -0.635,-3.175; 127 -1.905,3.175; 128 -1.905,1.905; 129 -1.905,0.635; 130 -1.905,-0.635; 131 -1.905,-1.905; 132 -1.905,-3.175; 133 -3.175,3.175; 134 -3.175,1.905; 135 -3.175,0.635; 136 -3.175,-0.635; 137 -3.175,-1.905; 138 -3.175,-3.175; 139 -4.445,3.175; 140 -4.445,1.905; 141 -4.445,0.635; 142 -4.445,-0.635; 143 -4.445,-1.905; 144 -4.445,-3.175; 145 -5.715,3.175; 146 -5.715,1.905; 147 -5.715,0.635; 148 -5.715,-0.635; 149 -5.715,-1.905; 150 -5.715,-3.175; 151 -6.985,3.175; 152 -6.985,1.905; 153 -6.985,0.635; 154 -6.985,-0.635; 155 -6.985,-1.905; 156 -6.985,-3.175; 157 -8.255,3.175; 158 -8.255,1.905; 159 -8.255,0.635; 160 -8.255,-0.635; 161 -8.255,-1.905; 162 -8.255,-3.175; 163 -9.525,3.175; 164 -9.525,1.905; 165 -9.525,0.635; 166 -9.525,-0.635; 167 -9.525,-1.905; 168 -9.525,-3.175; 169 -10.795,3.175; 170 -10.795,1.905; 171 -10.795,0.635; 172 -10.795,-0.635; 173 -10.795,-1.905; 174 -10.795,-3.175; 175 -12.065,3.175; 176 -12.065,1.905; 177 -12.065,0.635; 178 -12.065,-0.635; 179 -12.065,-1.905; 180 -12.065,-3.175; 181 -13.335,3.175; 182 -13.335,1.905; 183 -13.335,0.635; 184 -13.335,-0.635; 185 -13.335,-1.905; 186 -13.335,-3.175; 187 -14.605,3.175; 188 -14.605,1.905; 189 -14.605,0.635; 190 -14.605,-0.635; 191 -14.605,-1.905; 192 -14.605,-3.175; 193 -15.875,3.175; 194 -15.875,1.905; 195 -15.875,0.635; 196 -15.875,-0.635; 197 -15.875,-1.905; 198 -15.875,-3.175; 199 -17.145,3.175; 200 -17.145,1.905; 201 -17.145,0.635; 202 -17.145,-0.635; 203 -17.145,-1.905; 204 -17.145,-3.175; 205 -18.415,3.175; 206 -18.415,1.905; 207 -18.415,0.635; 208 -18.415,-0.635; 209 -18.415,-1.905; 210 -18.415,-3.175; 211 -19.685,3.175; 212 -19.685,1.905; 213 -19.685,0.635; 214 -19.685,-0.635; 215 -19.685,-1.905; 216 -19.685,-3.175; 217 -20.955,3.175; 218 -20.955,1.905; 219 -20.955,0.635; 220 -20.955,-0.635; 221 -20.955,-1.905; 222 -20.955,-3.175; 223 -22.225,3.175; 224 -22.225,1.905; 225 -22.225,0.635; 226 -22.225,-0.635; 227 -22.225,-1.905; 228 -22.225,-3.175; 229 -23.495,3.175; 230 -23.495,1.905; 231 -23.495,0.635; 232 -23.495,-0.635; 233 -23.495,-1.905; 234 -23.495,-3.175; 235 -24.765,3.175; 236 -24.765,1.905; 237 -24.765,0.635; 238 -24.765,-0.635; 239 -24.765,-1.905; 240 -24.765,-3.175 | hole 1.27: 27.191,0; -27.191,-3.048

### Placement (x,y rotation side)
3.3V_REG  15.75,48.26 180 bottom
5V_REG  29.21,48.26 180 bottom
BSPD_CONN  41.53,74.68 180 bottom
C1  91.44,36.83 270 bottom
C2  91.44,29.21 270 bottom
C3  91.44,21.59 270 bottom
C4  91.44,13.97 270 bottom
C5  68.71,76.71 0 top
C6  68.71,75.31 0 top
C7  89.53,77.09 90 top
C8  79.88,77.09 90 top
C9  24.64,48.26 270 bottom
C10  6.86,48.26 270 bottom
C11  26.67,46.23 90 bottom
C12  26.67,50.29 90 bottom
C13  68.71,76.71 180 bottom
C14  68.71,75.31 180 bottom
D1  39.62,56.64 270 bottom
D2  71.12,38.1 270 bottom
D3  7.91,62.45 0 bottom
D4  44.07,63.5 0 bottom
D5  20.57,12.19 180 bottom
D6  28.57,12.19 180 bottom
DASHBOARD_CONN  99.44,40.64 270 bottom
F  27.3,65.02 90 bottom
F1  17.27,65.02 90 bottom
F2  12.19,65.02 90 bottom
F3  49.02,65.15 270 top
F4  53.98,65.15 270 top
F5  59.05,65.15 270 top
F6  63.37,65.28 0 bottom
F7  22.73,10.41 0 bottom
F8  26.42,10.41 180 bottom
F9  56.9,4.45 90 top
F10  90.42,38.99 180 top
F11  92.71,54.61 90 bottom
F12  92.71,50.8 90 bottom
F13  92.71,46.99 90 bottom
F14  92.71,43.18 90 bottom
F15  90.17,61.59 270 bottom
F16  70.48,4.45 270 top
F17  62.87,30.73 270 bottom
F18  62.61,40.01 0 top
HV_BOX_CONN  21.34,2.16 0 bottom
PEDAL_CONN  48.9,2.16 0 bottom
Q1  19.68,63.5 0 bottom
Q2  14.66,63.5 0 bottom
Q3  90.17,47.62 90 bottom
Q4  90.17,43.81 90 bottom
Q5  90.17,51.44 90 bottom
Q6  90.17,55.24 90 bottom
Q7  65.91,28.96 0 bottom
Q8  63.37,43.56 180 top
Q9  63.88,61.47 0 bottom
Q10  59.94,64.39 0 bottom
Q11  17.4,58.04 0 bottom
Q13  33.4,59.56 270 bottom
Q14  95,73.91 90 top
Q15  95,64.01 90 top
Q16  95,67.31 90 top
Q17  95,70.61 90 top
R1  36.7,60.58 0 bottom
R2  20.7,60.07 90 bottom
R3  15.62,60.33 90 bottom
R4  64.9,58.67 90 bottom
R5  87.63,51.18 270 bottom
R6  82.04,46.99 0 bottom
R7  82.04,43.18 0 bottom
R8  19.05,15.24 180 bottom
R9  27.05,15.24 0 bottom
R10  82.04,54.61 0 bottom
R11  66.93,25.65 90 bottom
R12  64.39,46.86 270 top
R13  64.26,19.68 90 top
R14  73.66,36.45 270 bottom
R15  66.93,46.1 90 top
R16  60.96,26.54 270 bottom
R17  36.7,58.55 0 bottom
R18  82.04,50.8 180 bottom
R19  87.63,47.37 270 bottom
R20  87.63,43.56 270 bottom
R21  87.63,54.99 270 bottom
R22  63.25,63.88 0 bottom
R23  30.61,60.2 90 bottom
R24  24.26,60.07 270 bottom
R25  19.18,60.07 270 bottom
R26  97.66,71.63 90 top
R27  92.84,72.52 0 top
R28  97.66,63.63 270 top
R29  92.84,62.61 0 top
R30  97.66,66.29 90 top
R31  92.84,65.91 0 top
R32  97.66,68.96 90 top
R33  92.84,69.22 0 top
R34  44.32,61.09 180 bottom
R35  66.29,75.95 90 bottom
R36  85.09,41.78 0 bottom
SBRIO_ANALOG  62.36,18.54 0 bottom
SBRIO_AUX  62.36,34.8 0 bottom
SHOCK_POT_CONN  76.45,2.16 0 bottom
SHTDWN_CONN  12.19,74.68 180 bottom
THERM_CONN  99.44,13.08 270 bottom
THERMO_1  85.09,38.1 270 bottom
THERMO_2  85.09,30.48 270 bottom
THERMO_3  85.09,22.86 270 bottom
THERMO_4  85.09,15.24 270 bottom
U1  29.72,63.5 0 bottom
U2  84.71,75.18 0 top
U3  71.75,71.5 90 top
U$2  3.56,18.54 270 bottom
U$3  73.28,40.03 270 top
U$15  65.91,48.9 90 top
U$16  64.14,25.02 90 bottom
U$17  85.09,51.82 90 bottom
U$18  85.09,48.01 90 bottom
U$19  85.09,44.2 90 bottom
U$20  85.09,55.63 90 bottom
U$23  22.48,58.04 0 bottom
WHEEL_SPEED  99.44,68.2 270 bottom

### Tracks (layer width: path | path; a pad name or v marks a point on that pad's centre or on a via)
3.3V  (via drill 0.38)
  Top 0.406: Q15.P$3 95.94,64.9 95.5,64.9 95,65.41 95,68.2 | 95,68.2 95,71.5 | 95,71.5 95,75.69 95.08,75.78 | Q17.P$3 95.06,71.56 95,71.5 | Q16.P$3 95.06,68.26 95,68.2 | U3.16 68.03,70.53 67.44,71.12 67.44,72.77 | 67.44,72.77 67.44,74.89 C6.1 C5.1 67.86,77.38 70.23,79.76 v79.88,79.76 | 65.29,72.9 67.31,72.9 67.44,72.77 | U3.16 69.89,70.53 | 69.89,70.53 69.85,70.48 | 69.89,70.53 69.98,70.61 69.98,71.1 U3.15 | U3.16 U3.1 | U2.6 v81.28,76.28 79.93,76.28 C8.1 | U2.1 v88.14,76.28 88.65,76.28 89.49,76.28 C7.1
  Top 0.61: 43.56,72.9 65.29,72.9
  Top 0.635: 36.58,63.12 36.58,65.91 43.56,72.9 | C7.1 94.62,76.24 95.08,75.78 Q14.P$3
  Top 0.711: v28.45,54.99 v35.18,61.72 36.58,63.12
  Bottom 0.406: 91.22,20.95 C3.2 | 91.22,28.57 C2.2 | 91.22,36.2 C1.2 | THERMO_4.4 86.74,13.34 85.85,14.22 85.85,20.83 | THERMO_1.4 85.85,36.2 | 85.85,20.83 85.85,28.45 | 85.85,28.45 85.85,36.2 | 85.85,36.2 85.85,39.75 84.84,40.77 71.25,40.77 70.48,41.53 59.94,41.53 39.75,61.72 v35.18,61.72 | THERMO_2.4 85.98,28.57 85.85,28.45 | THERMO_3.4 85.98,20.95 85.85,20.83 | 91.22,13.34 C4.2 | C9.1 20.83,52.92 3.3V_REG.5 22.05,54.99 v28.45,54.99 | v79.88,79.76 79.88,77.68 v81.28,76.28 v88.14,76.28
  Bottom 0.711: THERMO_3.4 91.22,20.95 | THERMO_2.4 91.22,28.57 | THERMO_1.4 91.22,36.2 | THERMO_4.4 91.22,13.34
5V
  Top 0.889: 5V_REG.P$3 21.34,50.8 8.51,37.97 8.51,10.67 14.08,5.09 F9.2 F16.1 77.23,5.09 88.77,16.64 88.77,37.99 F10.2
  Bottom 1.016: C12.2 28.87,51.14 5V_REG.P$3
12V  (via drill 0.38, 0.64)
  Top 0.406: v60.96,29.72 53.85,29.72 v51.38,32.18 | Q8.P$3 v62.42,46.8
  Top 0.965: v62.1,56.64 v57.02,51.56
  Bottom 0.203: 51.38,37.59 51.38,34.04
  Bottom 0.406: 18.8,63.47 22.35,63.47 | Q1.P$3 18.73,63.41 18.8,63.47 | 18.8,63.47 13.72,63.47 | 13.72,63.47 7.92,63.47 | 13.72,63.47 13.71,63.46 Q2.P$3 13.71,56.81 3.3V_REG.1 10.67,52.92 C10.1 | 28.7,63.47 22.35,63.47 | SHTDWN_CONN.5 24.69,72.18 SHTDWN_CONN.6 22.35,67.34 22.35,63.47 | U1.P$3 28.77,63.4 28.7,63.47 | 5V_REG.P$1 44.58,45.72 51.38,38.91 51.38,37.59 | 90.17,57.2 Q6.P$3 87.71,57.66 82.17,57.66 80.14,55.63 80.14,51.56 79.38,50.8 69.47,50.8 68.71,51.56 62.42,51.56 | 90.17,57.66 90.17,52.32 | 90.17,52.32 90.17,48.64 | 90.17,48.64 90.17,45.77 Q4.P$3 | Q3.P$3 90.1,48.58 90.17,48.64 | Q5.P$3 90.11,52.38 90.17,52.32 | v57.02,51.56 62.42,51.56 | 28.7,63.47 58.91,63.47 Q10.P$3 | v62.42,46.8 62.42,51.56 | Q7.P$3 62.72,27.96 v60.96,29.72 | 51.38,34.04 v51.38,32.18
  Bottom 0.711: F15.2 90.17,57.66 90.17,57.2
  Bottom 0.762: v62.1,56.64 58.99,59.75 Q10.P$3
  Bottom 1.016: U1.P$3 28.77,56.45 30.86,54.36 30.86,47.37 5V_REG.P$1 28.87,45.38 C11.1
  pour Bottom (isolate 0.254): 4.45,48.39 4.45,62.36 6.86,64.77 14.86,64.77 20.32,70.23 20.32,75.69 20.83,76.2 25.78,76.2 29.34,72.64 29.34,65.66 30.73,64.26 60.07,64.26 61.72,62.61 61.72,59.05 63.75,57.02 78.61,57.02 85.85,64.01 91.06,64.01 91.19,43.81 84.84,43.94 84.84,37.59 50.55,37.59 43.94,44.2 25.65,44.2 25.65,46.35 29.46,46.35 30.61,47.5 30.61,52.83 25.02,58.42 16,58.42 14.99,57.4 14.99,56.01 7.37,48.39
AI1  (via drill 0.38)
  Top 0.203: 57.35,19.18 57.35,17.91
  Top 0.406: 57.35,17.91 57.35,16.08 54.1,12.83 v40.01,12.83 | SBRIO_ANALOG.P$6 57.35,19.54 57.35,19.18
  Bottom 0.406: HV_BOX_CONN.P$5 v40,12.83 v40.01,12.83
AI2  (via drill 0.38)
  Top 0.203: 47.37,34.04 47.37,37.59 | 55.37,19.18 55.37,17.91
  Top 0.406: 55.37,19.18 55.37,19.56 SBRIO_ANALOG.P$8 56.36,24.67 47.37,33.66 47.37,34.04 | 55.37,17.91 55.37,16.76 52.45,13.84 v38.99,13.84 | F5.2 59.03,64.47 59.03,56.11 47.37,44.45 47.37,37.59
  Bottom 0.406: HV_BOX_CONN.P$6 38.99,13.81 v38.99,13.84
AI3  (via drill 0.38)
  Top 0.203: 45.34,34.04 45.34,37.59 | 53.34,19.05 53.34,17.91 53.34,17.53
  Top 0.406: 53.34,19.05 53.34,19.56 SBRIO_ANALOG.P$12 52.36,26.38 45.34,33.4 45.34,34.04 | v53.34,16.13 53.34,17.91 | F4.2 54.03,64.45 54.03,52.38 45.34,43.69 45.34,37.59
  Bottom 0.406: PEDAL_CONN.P$7 53.34,2.6 v53.34,16.13
AI4
  Top 0.203: 43.36,34.04 43.36,37.59
  Top 0.406: SBRIO_ANALOG.P$14 50.36,26.35 43.36,33.35 43.36,34.04 | F3.2 49.02,56.01 51.94,53.09 51.94,51.56 43.75,43.37 43.61,43.23 43.36,42.98 43.36,37.59
  Bottom 0.203: 51.37,19.18 51.37,17.91
  Bottom 0.406: PEDAL_CONN.P$8 51.37,2.63 51.37,17.91 | 51.37,19.18 51.37,19.53 SBRIO_ANALOG.P$14
AI7
  Bottom 0.203: 41.35,17.91 41.35,19.18 41.35,19.5
  Bottom 0.406: PEDAL_CONN.P$4 41.35,3.7 41.35,17.91 | SBRIO_ANALOG.P$24 41.35,19.55 41.35,19.18
AI8
  Bottom 0.406: SBRIO_ANALOG.P$3 67.72,11.18 68.33,11.18 69.44,11.18 69.72,11.18 78.45,2.44 SHOCK_POT_CONN.P$8
AI9
  Bottom 0.406: SHOCK_POT_CONN.P$1 68.33,10.29 66.61,10.29 SBRIO_ANALOG.P$5
AI10
  Bottom 0.406: SHOCK_POT_CONN.P$2 67.22,9.4 63.5,9.4 SBRIO_ANALOG.P$9
AI11
  Top 0.203: 51.05,19.56 49.75,19.56 49.37,19.94 49.37,21.21
  Top 0.406: SBRIO_ANALOG.P$11 51.34,19.56 51.05,19.56 | 32.52,32.64 32.77,32.64
  Top 0.635: 32.77,32.64 39.37,32.64 49.37,22.64 49.37,21.21 | SBRIO_AUX.P$33 32.52,32.64
  Bottom 0.406: SHOCK_POT_CONN.P$3 66.1,8.51 62.39,8.51 SBRIO_ANALOG.P$11
AI12
  Top 0.203: 47.37,21.21 47.37,19.94
  Top 0.406: SBRIO_ANALOG.P$15 47.37,19.53 47.37,19.94
  Top 0.635: 32.13,31.75 38.23,31.75 47.37,22.61 47.37,21.21 | 32.13,31.75 31.66,31.75 | SBRIO_AUX.P$35 31.41,31.75 32.13,31.75
AI13
  Top 0.203: 45.34,21.21 45.34,19.94
  Top 0.406: SBRIO_ANALOG.P$17 45.34,19.56 45.34,19.94
  Top 0.635: 30.99,30.86 37.08,30.86 45.34,22.61 45.34,21.21 | 30.99,30.86 30.55,30.86 | SBRIO_AUX.P$37 30.29,30.86 30.99,30.86
AI15
  Top 0.203: SBRIO_ANALOG.P$23 39.37,19.53 39.37,21.21
  Top 0.635: 28.33,29.08 29.46,29.08 | 29.46,29.08 32.89,29.08 39.37,22.61 39.37,21.21 | SBRIO_AUX.P$41 28.07,29.08 29.46,29.08
AMS_OK
  Bottom 0.711: D6.P$1 27.8,10.41 F8.2
AMS_OUT
  Bottom 0.711: F12.2 91.19,51.45 Q5.P$1
AO0
  Top 0.635: 27.21,28.19 27.94,28.19 | 27.94,28.19 28.7,28.19 SBRIO_ANALOG.P$28 | SBRIO_AUX.P$43 26.96,28.19 27.94,28.19
AO1
  Top 0.635: 26.1,27.3 27.05,27.3 | 27.05,27.3 27.59,27.3 SBRIO_ANALOG.P$30 | SBRIO_AUX.P$45 25.85,27.3 27.05,27.3
AO2
  Top 0.635: 24.99,26.42 25.65,26.42 | 25.65,26.42 26.48,26.42 SBRIO_ANALOG.P$32 | SBRIO_AUX.P$47 24.74,26.42 25.65,26.42
AO3
  Top 0.635: 23.88,25.53 24.64,25.53 | 24.64,25.53 25.37,25.53 SBRIO_ANALOG.P$34 | SBRIO_AUX.P$49 23.63,25.53 24.64,25.53
BSPD_OUT
  Bottom 0.711: F14.2 91.19,43.83 Q4.P$1
BUZZER_OUT
  Bottom 0.711: Q6.P$1 91.19,55.26 F11.2
CAN_GND
  Top 0.406: U$2.P$6 U$2.P$3
  Bottom 0.635: HV_BOX_CONN.P$1 21.34,4.57 U$2.P$3
CAN_H
  Top 0.406: DASHBOARD_CONN.P$2 100.84,37.24 100.84,6.48 95.12,0.76 18.73,0.76 HV_BOX_CONN.P$3
  Bottom 0.635: HV_BOX_CONN.P$3 17.34,3.49 U$2.P$7
CAN_L
  Top 0.406: HV_BOX_CONN.P$4 7.24,10.26 7.24,24 5.97,25.27 3.56,25.27 2.29,24 U$2.P$2
  Bottom 0.406: DASHBOARD_CONN.P$3 100.84,35.24 100.84,6.48 95.12,0.76 16.73,0.76 HV_BOX_CONN.P$4
DIO0  (via drill 0.38)
  Top 0.406: R27.2 94,73.03 Q14.P$1 v92.96,73.91 | U$3.228 69.34,62.26 v69.09,62
  Bottom 0.406: v92.96,73.91 88.14,69.09 84.58,69.09 77.5,62 v69.09,62
DIO1  (via drill 0.38)
  Top 0.406: R33.2 94,69.72 Q17.P$1 v92.96,70.61 | U$3.216 67.59,59.72 v67.56,59.69
  Bottom 0.406: v92.96,70.61 90.55,68.2 84.71,68.2 77.72,61.21 71.37,61.21 69.85,59.69 v67.56,59.69
DIO2  (via drill 0.38)
  Top 0.203: U$3.210 68.83,58.45 v68.71,58.32
  Top 0.406: R31.2 94,66.42 Q16.P$1 v92.96,67.31
  Bottom 0.406: v92.96,67.31 84.84,67.31 77.98,60.45 71.75,60.45 69.62,58.32 v68.71,58.32
DIO3  (via drill 0.38)
  Top 0.203: U$3.198 68.48,55.91 v67.94,55.37
  Top 0.406: 93.98,63.99 93.98,63.1 R29.2 | v92.96,64.01 Q15.P$1
  Top 0.711: 93.98,63.99 Q15.P$1
  Bottom 0.406: v92.96,64.01 83.31,64.01 74.68,55.37 v67.94,55.37
DIO6  (via drill 0.38)
  Top 0.406: U$3.174 68.07,50.83 v67.94,50.7
  Bottom 0.406: R18.1 80.64,50.8 79.88,50.04 69.11,50.04 68.45,50.7 v67.94,50.7
DIO7  (via drill 0.38)
  Top 0.406: U$3.162 v68.33,48.28
  Bottom 0.406: v68.33,48.28 80.1,48.28 R6.2
DIO8  (via drill 0.38)
  Top 0.406: U$3.156 70.1,46.99 69.09,46.99 v68.58,46.48
  Bottom 0.406: R7.2 71.88,43.18 v68.58,46.48
DIO9  (via drill 0.38)
  Top 0.406: U$3.144 v67.94,44.48
  Bottom 0.406: R36.2 71.5,41.78 68.81,44.48 v67.94,44.48
DIO10  (via drill 0.38)
  Top 0.406: U$3.138 v67.94,43.2
  Bottom 0.406: D4.P$2 44.97,62.45 R34.2 45.02,61.04 45.02,57.72 59.54,43.2 v67.94,43.2
DIO11  (via drill 0.38)
  Top 0.406: U$3.126 v67.94,40.66
  Bottom 0.406: v67.94,40.66 59.54,40.66 39.62,60.58 R1.1
DIO12  (via drill 0.38)
  Top 0.406: U$3.120 v67.97,39.4
  Bottom 0.406: v67.97,39.4 71.78,39.4 D2.P$2 73.66,37.51 R14.1
DIO13  (via drill 0.38)
  Top 0.406: v64.9,56.9 v56.01,48.01 | U$3.108 68.17,36.85 65.53,39.5 v65.53,44.2
  Bottom 0.406: v65.53,44.2 59.82,44.2 v56.01,48.01
  Bottom 0.711: R4.1 v64.9,56.9
DIO14  (via drill 0.38)
  Top 0.406: v81.41,52.96 85.09,49.28 85.09,37.97 82.68,35.56 82.68,34.42 v80.64,32.38 | U$3.102 68.58,35.59 v67.94,34.95 66.4,33.4 61.75,33.4 SBRIO_AUX.P$3
  Bottom 0.406: v80.64,32.38 73.3,32.38 70.74,34.95 v67.94,34.95 | v81.41,52.96 81.41,54.59 R10.2
DIO15
  Top 0.406: U$3.90 69.57,32.51 60.64,32.51 SBRIO_AUX.P$5
DIO16  (via drill 0.38)
  Top 0.203: 69.6,64.16 73.28,64.16 U$3.231 | 49.38,34.04 49.38,35.43
  Top 0.406: 69.6,64.16 68.35,64.16 48.36,44.17 SBRIO_AUX.P$16 49.38,35.78 49.38,35.43 | v60.96,28.19 54.1,28.19 49.38,32.92 49.38,34.04
  Bottom 0.711: R16.1 v60.96,28.19
DIO17
  Top 0.203: 69.6,62.89 73.28,62.89 U$3.225
  Top 0.406: 69.6,62.89 68.22,62.89 64.14,58.8 64.14,57.4 50.36,43.63 SBRIO_AUX.P$14
DIO18
  Top 0.203: 68.66,59.08 73.28,59.08 U$3.213
  Top 0.406: 68.66,59.08 68.35,59.08 52.36,43.09 SBRIO_AUX.P$12
DIO19  (via drill 0.38)
  Top 0.203: v77.72,59.59 77.22,59.08 74.55,59.08 U$3.207
  Top 0.406: v66.17,55.63 55.05,44.51 54.61,44.07 54.36,43.82 SBRIO_AUX.P$10
  Bottom 0.406: v66.17,55.63 66.67,56.13 68.71,56.13 72.42,59.59 v77.72,59.59
DIO20  (via drill 0.38)
  Top 0.203: U$3.195 73.28,55.27 68.86,55.27 68.2,54.61 v67.26,54.61
  Top 0.406: v44.32,54.61 v49.28,54.61
  Bottom 0.406: v49.28,54.61 v67.26,54.61 | v44.32,54.61 41.34,57.59 D1.P$2 39.67,58.55 R17.1
DIO29  (via drill 0.38)
  Top 0.203: v77.6,38.76 74.55,38.76 U$3.117
  Top 0.406: U2.7 82.17,75.18 81.92,74.93 81.92,53.72 85.98,49.66 85.98,37.72 v83.44,35.18
  Bottom 0.406: v77.6,38.76 81.18,35.18 v83.44,35.18
DIO30  (via drill 0.38)
  Top 0.203: U$3.105 74.55,36.22 v77.6,36.22
  Top 0.406: 85.91,69.86 85.91,51 86.87,50.04 86.87,37.47 83.69,34.29 v83.44,34.29 | U2.12 v85.91,70.74 85.91,69.86 | 85.91,69.86 85.9,69.85 | U3.4 72.73,68.75 v74.68,66.8
  Bottom 0.406: v83.44,34.29 79.53,34.29 v77.6,36.22 | v85.91,70.74 84.2,70.74 80.26,66.8 v74.68,66.8
DIO31  (via drill 0.38)
  Top 0.203: U$3.99 74.55,34.95 v77.6,34.95
  Top 0.406: U2.13 v86.71,71.5 86.71,51.47 87.76,50.42 87.76,37.21 83.95,33.4 v83.44,33.4 | v72.64,67.56 72.08,68.13 U3.3
  Bottom 0.406: v83.44,33.4 79.15,33.4 v77.6,34.95 | v86.71,71.5 83.95,71.5 80.01,67.56 v72.64,67.56
DIO32  (via drill 0.38)
  Top 0.203: U$3.221 70.74,61.62 69.75,61.62 69.47,61.34 v68.33,61.34
  Top 0.406: v88.65,74.68 88.14,75.18 U2.14 | U3.2 v71.43,66.04
  Bottom 0.406: v68.33,61.34 68.33,64.64 69.72,66.04 v71.43,66.04 80.52,66.04 84.45,69.98 86.74,69.98 88.65,71.88 v88.65,74.68
DIO33  (via drill 0.38)
  Top 0.203: U$3.215 70.99,59.72 70.36,60.35 67.92,60.35 v67.56,60.71
  Top 0.406: U3.5 74.38,70.53 v74.8,70.1
  Bottom 0.406: v67.56,60.71 67.56,67.31 70.36,70.1 v74.8,70.1
DIO34  (via drill 0.38)
  Top 0.203: U$3.203 70.74,57.81 69.49,57.81 69.22,57.53 67.94,57.53 v67.56,57.15
  Top 0.406: U3.7 74.37,71.83 v74.8,72.26
  Bottom 0.406: v67.56,57.15 66.04,58.67 66.04,67.82 70.48,72.26 v74.8,72.26
DIO35  (via drill 0.38)
  Top 0.203: U$3.197 70.74,56.54 68.81,56.54 v68.45,56.9
  Top 0.406: U3.6 v74.8,71.18
  Bottom 0.406: v68.45,56.9 68.45,57.53 66.8,59.18 66.8,67.56 70.41,71.18 v74.8,71.18
DIO36  (via drill 0.38)
  Top 0.203: 76.96,54 74.83,54 74.55,53.72 74.55,53.09 74.19,52.73 72.01,52.73 U$3.185
  Top 0.406: U2.8 82.71,62.13 v82.68,62.1 | 76.96,54 77.11,54 77.6,54.48 77.6,57.02 v78.74,58.17
  Bottom 0.406: v82.68,62.1 v78.74,58.17
DIO37  (via drill 0.38)
  Top 0.203: 76.96,51.46 72.01,51.46 U$3.179
  Top 0.406: U2.9 83.51,61.66 v82.68,60.83 | v78.74,57.02 78.74,52.7 77.5,51.46 76.96,51.46
  Bottom 0.406: v82.68,60.83 v78.74,57.02
DIO38
  Top 0.203: 67.77,48.92 70.74,48.92 U$3.167
  Top 0.305: 66.4,48.92 65.53,49.78 64.14,49.78
  Top 0.406: 64.14,49.78 57.02,42.67 57.02,37.46 SBRIO_AUX.P$8 | 67.77,48.92 66.4,48.92
DIO39
  Top 0.203: U$3.161 70.74,47.65 69.6,47.65 68.73,47.65 67.94,46.86 67.94,46.1 67.3,45.45 R15.1
GND  (via drill 0.38, 3.17 pad 3.81)
  Top 0.406: SBRIO_AUX.P$24 SBRIO_AUX.P$22 | SBRIO_AUX.P$31 SBRIO_AUX.P$29 SBRIO_AUX.P$27 SBRIO_AUX.P$25 SBRIO_AUX.P$23 | SBRIO_AUX.P$23 SBRIO_AUX.P$21 | SBRIO_AUX.P$23 SBRIO_AUX.P$24 | SBRIO_AUX.P$13 SBRIO_AUX.P$11 SBRIO_AUX.P$9 SBRIO_AUX.P$7 | SBRIO_ANALOG.P$26 SBRIO_ANALOG.P$25 SBRIO_ANALOG.P$27 SBRIO_ANALOG.P$29 SBRIO_ANALOG.P$31 SBRIO_ANALOG.P$33 SBRIO_ANALOG.P$35 SBRIO_ANALOG.P$37 SBRIO_ANALOG.P$39 SBRIO_ANALOG.P$41 SBRIO_ANALOG.P$43 SBRIO_ANALOG.P$45 SBRIO_ANALOG.P$47 SBRIO_ANALOG.P$49 12.19,20.71 12.19,34.63 SBRIO_AUX.P$50 SBRIO_AUX.P$48 SBRIO_AUX.P$46 SBRIO_AUX.P$44 SBRIO_AUX.P$42 SBRIO_AUX.P$40 SBRIO_AUX.P$38 SBRIO_AUX.P$36 SBRIO_AUX.P$34 SBRIO_AUX.P$32 SBRIO_AUX.P$30 SBRIO_AUX.P$28 SBRIO_AUX.P$26 SBRIO_AUX.P$24 | R13.1 62.85,19.04 SBRIO_ANALOG.P$1 | v33.91,61.98 33.91,68.89 SHTDWN_CONN.10 | C7.2 85.91,77.94 | 85.91,77.94 84.31,77.94 | 84.31,77.94 83.51,77.94 | 83.51,77.94 C8.2 76.03,77.94 75.06,76.96 | U2.5 83.51,77.94 | U2.4 84.31,77.94 | U2.2 85.91,77.94 | R27.1 R33.1 R31.1 R29.1 92.19,62.12 93.47,60.83 99.95,60.83 100.84,61.72 100.84,74.8 WHEEL_SPEED.P$5 97.7,77.94 C7.2 | C7.2 89.95,77.94 | 75.06,76.96 v74.93,76.83 72.9,74.8 | v3.2,3.2 0.76,5.64 0.76,74.4 v3.2,76.83 | 72.9,74.8 72.73,74.64 U3.9 | U3.9 U3.10 U3.11 U3.12 U3.13 | C6.2 70.06,74.8 72.9,74.8 | C5.2 C6.2 | v68.33,74.17 68.41,74.17 C6.2 | 75.06,76.96 77.6,74.42 77.6,68.48 U$3.237 | U3.8 U3.9 | U$15.P$3 v68.26,49.84
  Bottom 0.406: THERMO_4.2 90.39,15.88 C4.1 | THERMO_3.2 90.39,23.5 C3.1 92.5,22.44 92.58,22.35 | THERMO_2.2 90.39,31.11 C2.1 92.37,30.06 92.58,29.84 | C1.1 90.39,38.73 THERMO_1.2 THERMO_1.1 87.69,40.03 | C1.1 91.53,37.59 92.58,37.59 92.58,29.84 | C4.1 91.53,14.73 | 92.58,29.84 92.58,22.35 | 92.58,22.35 92.58,14.82 | SBRIO_ANALOG.P$19 SBRIO_ANALOG.P$22 42.36,22.04 42.55,22.23 | SBRIO_ANALOG.P$13 SBRIO_ANALOG.P$16 48.36,21.94 48.64,22.23 | 54.23,22.23 58.67,22.23 SBRIO_ANALOG.P$4 SBRIO_ANALOG.P$1 64.07,16.83 | 54.23,22.23 48.64,22.23 | 48.64,22.23 42.55,22.23 | 42.55,22.23 40.04,22.23 SBRIO_ANALOG.P$26 | 54.23,22.23 54.36,22.1 SBRIO_ANALOG.P$10 SBRIO_ANALOG.P$7 | 64.07,16.83 68.71,12.19 70.42,12.19 SHOCK_POT_CONN.P$7 85.38,7.08 THERM_CONN.P$4 THERM_CONN.P$3 THERM_CONN.P$2 THERM_CONN.P$1 94.32,13.08 92.58,14.82 | SBRIO_AUX.P$22 SBRIO_AUX.P$20 SBRIO_AUX.P$18 | SBRIO_AUX.P$21 SBRIO_AUX.P$19 SBRIO_AUX.P$17 SBRIO_AUX.P$15 SBRIO_AUX.P$13 | 92.58,14.82 C4.1 | C1.1 91.44,37.97 | 18.4,18.5 SBRIO_ANALOG.P$45 | 26.4,18.5 SBRIO_ANALOG.P$37 | C11.2 27.85,48.26 5V_REG.P$2 | C11.2 C12.1 | SHTDWN_CONN.10 34.69,72.18 SHTDWN_CONN.9 | SHTDWN_CONN.9 30.03,76.83 v3.2,76.83 | C11.2 24.97,47.08 C9.2 23.53,47.41 3.3V_REG.7 | 16.45,55.63 Q11.P$3 | 3.3V_REG.7 3.3V_REG.9 13.21,47.37 | R36.1 85.74,42.53 85.09,43.18 85.09,45.15 | 85.09,52.77 85.09,55.58 U$20.P$3 | 85.09,52.77 85.09,48.96 | 85.09,48.96 85.09,45.15 | U$19.P$3 85.09,45.15 | 85.09,48.96 U$18.P$3 81.35,48.96 81.03,49.28 68.83,49.28 v68.26,49.84 | U$17.P$3 85.09,52.77 | 13.21,47.37 13.21,52.38 16.45,55.63 | 64.07,20.26 68.2,24.38 68.2,30.5 66.67,32.03 66.67,34.92 67.55,35.8 R14.2
  Bottom 0.406: Q13.P$3 33.4,59.61 33.4,61.47 v33.91,61.98 34.42,62.48 40.26,62.48 41.66,61.09 R34.1 | Q9.P$3 63.93,61.47 64.52,61.47 65.28,62.23 65.28,68.07 66.55,69.34 66.55,74.84 R35.1 66.51,75.31 | SHTDWN_CONN.9 35.62,78.11 62.48,78.11 65.28,75.31 66.51,75.31 | U$23.P$3 20.21,57.04 18.8,55.63 16.45,55.63 | 66.51,75.31 C14.1 67.86,74.64 v68.33,74.17 | 13.21,47.37 6.9,47.37 C10.2 0.76,41.31 0.76,5.64 v3.2,3.2 | U$16.P$3 64.07,25.03 64.07,20.26 | 64.07,20.26 64.07,16.83 | SBRIO_AUX.P$46 18.29,36.87 3.3V_REG.7 | R17.2 35.99,58.61
  Bottom 0.635: 35.99,58.61 Q13.P$3
  Bottom 0.711: THERMO_2.2 THERMO_2.1 | THERMO_3.2 THERMO_3.1 | THERMO_4.2 THERMO_4.1 | R36.1 87.69,40.03 | R8.1 18.4,18.5 | R9.2 26.4,18.5
  pour Bottom (isolate 0.254, rank 5): 0.13,81.15 101.47,81.15 101.47,0.13 0.13,0.13
  pour Top (isolate 0.254, rank 5): 0.13,81.15 101.47,81.15 101.47,0.13 0.13,0.13
IMD_OK
  Bottom 0.711: D5.P$1 21.35,10.41 F7.2
IMD_OUT
  Bottom 0.711: F13.2 91.19,47.64 Q3.P$1
N$1
  Bottom 0.406: D2.P$1 68.82,36.8 SBRIO_AUX.P$2
N$2
  Bottom 0.406: D1.P$1 38.62,55.74 40.64,53.72 45.21,53.72 60.36,38.58 SBRIO_AUX.P$4
N$3
  Top 0.711: R32.1 99.33,68.31 WHEEL_SPEED.P$1
N$4  (via drill 0.38)
  Top 0.406: R13.2 62.56,20.34 SBRIO_ANALOG.P$2
  Top 0.635: v29.84,58.17 26.42,61.47 v10.29,61.47
  Bottom 0.203: 59.36,34.04 59.36,37.59
  Bottom 0.406: v10.29,61.47 10.27,61.45 | SBRIO_ANALOG.P$2 59.36,23.54 59.36,34.04 | 59.36,37.59 59.36,38.3 47.69,49.97 47.37,50.29 44.83,52.83 35.18,52.83 v29.84,58.17
  Bottom 0.711: 10.27,61.45 D3.P$2
N$5
  Bottom 0.711: R21.2 89.12,54.34 Q6.P$2
N$6
  Top 0.711: R30.2 96.58,66.94 Q16.P$2
N$7
  Bottom 0.711: Q1.P$1 17.4,64.5 F1.1
N$8
  Bottom 0.711: Q2.P$1 12.32,64.5 F2.1
N$9
  Top 0.711: R28.1 99.36,64.28 WHEEL_SPEED.P$3
N$10
  Top 0.711: R26.1 98.66,70.98 WHEEL_SPEED.P$8
N$11  (via drill 0.38)
  Top 0.152: 73.75,54.63 U$3.189
  Top 0.203: U$3.189 73.28,54 69.62,54 68.96,53.34 v67.94,53.34
  Top 0.406: v50.16,53.72 28.07,53.72 25.65,56.13 v25.65,60.33
  Bottom 0.406: v50.16,53.72 67.56,53.72 v67.94,53.34
  Bottom 0.711: R24.1 25.26,60.72 v25.65,60.33
N$12  (via drill 0.38)
  Top 0.203: 76.96,52.73 74.83,52.73 74.19,52.09 U$3.177
  Top 0.406: v51.05,52.83 25.27,52.83 v17.65,60.45 | 76.96,52.73 77.57,52.73 v77.95,53.11
  Bottom 0.406: 57.28,52.83 v51.05,52.83 67.31,52.83 67.56,52.58 77.42,52.58 v77.95,53.11
  Bottom 0.711: R25.1 17.92,60.72 v17.65,60.45
N$13
  Bottom 0.711: HV_BOX_CONN.P$7 25.77,2.59 F8.1
N$14
  Bottom 0.711: HV_BOX_CONN.P$8 23.38,2.21 F7.1
N$15  (via drill 0.38)
  Top 0.203: 64.77,52.96 65.79,53.98 68.58,53.98 69.24,54.63 U$3.192
  Top 0.406: 64.77,52.96 55.24,43.43 v55.24,41.15
  Bottom 0.203: 53.34,37.59 53.34,34.04 | 21.34,21.21 21.34,17.91
  Bottom 0.406: 21.34,21.21 21.34,22.86 28.7,30.23 52.32,30.23 53.34,31.24 53.34,34.04 | 19.7,13.27 D5.P$2 | 21.34,17.91 21.34,16.88 R8.2 | v55.24,41.15 53.34,39.24 53.34,37.59
  Bottom 0.711: R8.2 19.7,13.27
N$16  (via drill 0.38)
  Top 0.406: U$3.180 65.18,52.09 56.13,43.05 v56.13,38.86
  Bottom 0.203: 55.32,34.04 55.32,37.59 | 29.34,17.91 29.34,21.08
  Bottom 0.406: 29.34,21.08 29.34,22.86 35.81,29.34 53.47,29.34 55.32,31.19 55.32,34.04 | 27.7,13.27 D6.P$2 | 29.34,17.91 29.34,16.88 R9.1 | 55.32,37.59 55.32,38.05 v56.13,38.86
  Bottom 0.711: R9.1 27.7,13.27
N$17  (via drill 0.38)
  Top 0.203: 76.96,50.19 74.55,50.19 U$3.171
  Top 0.406: v84.2,40.01 84.2,45.85 80.58,49.47 79.86,50.19 76.96,50.19
  Bottom 0.406: THERMO_4.7 83.57,15.88 84.2,16.51 84.2,23.5 | THERMO_3.7 84.2,23.5 | 84.2,23.5 84.2,31.11 | THERMO_2.7 84.2,31.11 | 84.2,31.11 85.09,32 85.09,39.12 v84.2,40.01 84.2,39.37 83.57,38.73 THERMO_1.7
N$18  (via drill 0.38)
  Top 0.203: 76.96,47.65 74.55,47.65 U$3.159
  Top 0.406: 81.53,38.35 81.53,34.42 79.88,32.77 79.88,30.23 v79.12,29.46 | 81.53,38.35 81.53,44.96 78.84,47.65 76.96,47.65 | v84.33,38.35 81.53,38.35
  Bottom 0.406: THERMO_4.5 80.9,13.34 79.12,15.11 79.12,20.83 | 79.12,20.83 79.12,28.45 | THERMO_2.5 79.25,28.57 79.12,28.45 | THERMO_3.5 79.25,20.95 79.12,20.83 | v79.12,29.46 79.12,28.45 | THERMO_1.5 83.69,36.2 84.33,36.83 v84.33,38.35
N$20
  Top 0.711: F16.2 70.45,3.76 SHOCK_POT_CONN.P$4
N$21
  Bottom 0.406: 99.39,62.24 WHEEL_SPEED.P$4
  Bottom 0.711: F15.1 99.39,62.24
N$22
  Top 0.711: F9.1 PEDAL_CONN.P$5
N$23
  Top 0.711: DASHBOARD_CONN.P$4 95.42,34.64 F10.1
N$24
  Bottom 0.711: F11.1 94.12,53.96 DASHBOARD_CONN.P$5
N$25  (via drill 0.38)
  Top 0.203: 76.96,46.38 74.55,46.38 U$3.153
  Top 0.406: v80.64,38.1 80.64,44.07 78.33,46.38 76.96,46.38
  Bottom 0.406: v80.64,38.1 81.28,37.47 THERMO_1.6
N$26  (via drill 0.38)
  Top 0.203: 76.96,45.11 74.55,45.11 U$3.141
  Top 0.406: 76.96,45.11 77.57,45.11 79.88,42.8 79.88,33.91 78.99,33.02 v78.99,31.11
  Bottom 0.406: THERMO_2.6 80.26,29.84 v78.99,31.11
N$27  (via drill 0.38)
  Top 0.203: U$3.135 74.55,42.57 76.96,42.57
  Top 0.406: v80.01,24 78.11,25.91 78.11,33.15 79.12,34.16 79.12,41.02 77.44,42.57 76.96,42.57
  Bottom 0.406: THERMO_3.6 81.15,22.23 80.01,23.37 v80.01,24
N$28  (via drill 0.38)
  Top 0.203: 76.96,40.03 74.55,40.03 U$3.123
  Top 0.406: v80.01,15.75 77.34,18.41 77.34,33.4 78.36,34.42 78.36,39.12 77.44,40.03 76.96,40.03
  Bottom 0.406: THERMO_4.6 81.15,14.61 v80.01,15.75
N$29  (via drill 0.38)
  Top 0.711: v89.79,37.47 99.44,27.81 THERM_CONN.P$5
  Bottom 0.711: THERMO_1.3 v89.79,37.47
N$30  (via drill 0.38)
  Top 0.711: v89.79,29.84 89.79,28.73 THERM_CONN.P$6
  Bottom 0.711: THERMO_2.3 v89.79,29.84
N$31  (via drill 0.38)
  Top 0.711: v89.79,22.23 94.3,22.23 THERM_CONN.P$7
  Bottom 0.711: THERMO_3.3 v89.79,22.23
N$32  (via drill 0.38)
  Top 0.711: THERM_CONN.P$8 90.27,15.08 v89.79,14.61
  Bottom 0.711: THERMO_4.3 v89.79,14.61
N$33
  Bottom 0.711: F12.1 95.93,50.15 DASHBOARD_CONN.P$6
N$34
  Bottom 0.711: F13.1 97.74,46.34 DASHBOARD_CONN.P$7
N$35
  Bottom 0.711: F14.1 99.33,42.53 DASHBOARD_CONN.P$8
N$36
  Bottom 0.711: F.2 27.3,67.29 SHTDWN_CONN.8
  Bottom 1.651: SHTDWN_CONN.7 29.69,72.18 SHTDWN_CONN.8
N$37  (via drill 0.38)
  Top 0.406: U3.14 68.33,71.83 v68.33,71.88
  Bottom 0.406: C13.2 C14.2 69.6,75.27 69.6,74.3 68.33,73.03 v68.33,71.88
N$38
  Bottom 0.406: R35.2 66.38,76.71 C13.1
N$39
  Bottom 0.711: F1.2 17.27,67.26 SHTDWN_CONN.4
  Bottom 1.651: SHTDWN_CONN.3 19.69,72.18 SHTDWN_CONN.4
N$40
  Bottom 0.711: F2.2 12.19,67.18 SHTDWN_CONN.2
  Bottom 1.651: SHTDWN_CONN.1 14.69,72.18 SHTDWN_CONN.2
N$41
  Bottom 0.711: F6.1 BSPD_CONN.10
  Bottom 1.651: BSPD_CONN.9 64.03,72.18 BSPD_CONN.10
N$42
  Bottom 0.406: 44.07,69.64 BSPD_CONN.2
  Bottom 0.711: D4.P$1 44.07,69.64
  Bottom 1.651: BSPD_CONN.1 44.03,72.18 BSPD_CONN.2
N$43
  Top 0.406: 59.05,69.65 BSPD_CONN.8
  Top 0.711: F5.1 59.05,69.65
  Bottom 1.651: BSPD_CONN.7 59.03,72.18 BSPD_CONN.8
N$44
  Bottom 0.711: U1.P$1 27.43,64.5 F.1
N$45
  Bottom 0.711: Q10.P$1 60.05,65.28 F6.2
N$46
  Bottom 0.711: U1.P$2 30.61,62.44 R23.2
N$47
  Bottom 0.406: 20.7,62.43 Q1.P$2
  Bottom 0.711: R2.2 20.7,62.43
N$48
  Bottom 0.406: 15.62,62.48 Q2.P$2
  Bottom 0.711: R3.2 15.62,62.48
N$49
  Bottom 0.711: Q10.P$2 61.39,63.88 R22.2
N$50
  Bottom 0.711: R5.2 89.12,50.53 Q5.P$2
N$51
  Bottom 0.711: R19.2 89.12,46.72 Q3.P$2
N$52
  Top 0.406: 53.98,69.62 BSPD_CONN.6
  Top 0.711: F4.1 53.98,69.62
  Bottom 1.651: BSPD_CONN.5 54.03,72.18 BSPD_CONN.6
N$53
  Top 0.406: 49.02,69.67 BSPD_CONN.4
  Top 0.711: F3.1 49.02,69.67
  Bottom 1.651: BSPD_CONN.3 49.03,72.18 BSPD_CONN.4
N$54
  Bottom 0.406: R11.2 66.93,27.89 Q7.P$2
N$55
  Bottom 0.406: F17.1 62.87,34.29 SBRIO_AUX.P$1
N$56
  Bottom 0.406: Q7.P$1 62.99,29.96 F17.2
N$57
  Top 0.711: F18.2 63.26,42.45 Q8.P$1
N$58
  Top 0.406: Q8.P$2 64.32,44.78
  Top 0.711: R12.2 64.39,44.63 Q8.P$2
N$59
  Top 0.406: SBRIO_AUX.P$6 61.56,40.01 F18.1
  Top 0.711: F18.1 61.82,40.01
N$60
  Top 0.711: R15.2 66.93,47.93 U$15.P$2
N$61
  Top 0.711: U$15.P$1 64.39,48.37 R12.1
N$62
  Bottom 0.406: U$16.P$2 62.78,24.07 R16.2
N$63
  Bottom 0.406: U$16.P$1 66.91,25.02 R11.1
N$64
  Bottom 0.711: R5.1 86.11,51.83 U$17.P$1
N$65
  Bottom 0.711: U$17.P$2 82.76,50.87 R18.2
N$66
  Bottom 0.711: U$18.P$1 87.61,48.01 R19.1
N$67
  Bottom 0.711: U$18.P$2 82.76,47.06 R6.1
N$68
  Bottom 0.711: R20.2 89.12,42.91 Q4.P$2
N$69
  Bottom 0.711: U$19.P$1 87.61,44.2 R20.1
N$70
  Bottom 0.711: U$19.P$2 82.76,43.25 R7.1
N$71
  Bottom 0.711: R21.1 86.11,55.64 U$20.P$1
N$72
  Bottom 0.711: U$20.P$2 82.76,54.68 R10.1
N$73
  Bottom 0.711: R22.1 63.88,63.87 Q9.P$1
N$74
  Bottom 0.711: Q9.P$2 64.9,60.4 R4.2
N$75
  Bottom 0.711: R23.1 30.62,59.56 Q13.P$1
N$76
  Bottom 0.635: 34.47,60.58 R1.2
  Bottom 0.711: Q13.P$2 34.47,60.58
N$77
  Bottom 0.711: R2.1 22.1,59.42 U$23.P$1
N$78
  Bottom 0.711: Q11.P$1 16.26,59.04 R3.1
N$79
  Bottom 0.711: R24.2 24.26,57.87 U$23.P$2
N$80
  Bottom 0.711: R25.2 19.18,57.87 Q11.P$2
N$81
  Top 0.711: Q14.P$2 96.98,72.96 R26.2
N$82
  Top 0.711: R28.2 96.08,62.98 Q15.P$2
N$83
  Top 0.711: R30.1 98.89,65.64 WHEEL_SPEED.P$2
N$84
  Top 0.711: R32.2 96.05,69.61 Q17.P$2
SHIELD
  Top 0.406: U$2.P$5 6.35,17.02 6.35,12.83 5.46,11.94 3.81,11.94 U$2.P$10
  Bottom 0.635: HV_BOX_CONN.P$2 19.34,4.03 U$2.P$5
STEERING_POS
  Top 0.203: 41.35,21.21 41.35,19.94
  Top 0.406: SBRIO_ANALOG.P$21 41.35,19.55 41.35,19.94
  Top 0.635: 29.72,29.97 34.04,29.97 41.35,22.66 41.35,21.21 | 29.72,29.97 29.44,29.97 | SBRIO_AUX.P$39 29.18,29.97 29.72,29.97
  Bottom 0.406: SBRIO_ANALOG.P$21 42.36,4.7 PEDAL_CONN.P$3
THROTTLE_1
  Bottom 0.203: 47.37,17.91 47.37,19.18
  Bottom 0.406: SBRIO_ANALOG.P$18 47.37,19.53 47.37,19.18 | PEDAL_CONN.P$1 47.37,3.68 47.37,17.91
THROTTLE_2
  Bottom 0.203: 45.34,17.91 45.34,19.18
  Bottom 0.406: SBRIO_ANALOG.P$20 45.34,19.56 45.34,19.18 | 45.34,17.91 45.34,3.71 PEDAL_CONN.P$2

### Text on the board
bPlace: Layout By: Kendall Searing | Formula Electric 2014: sbRIO Daughter Card v4 | Design By: Thomas Willson